# EAGLE board piboard (EAGLE 9.6.2)
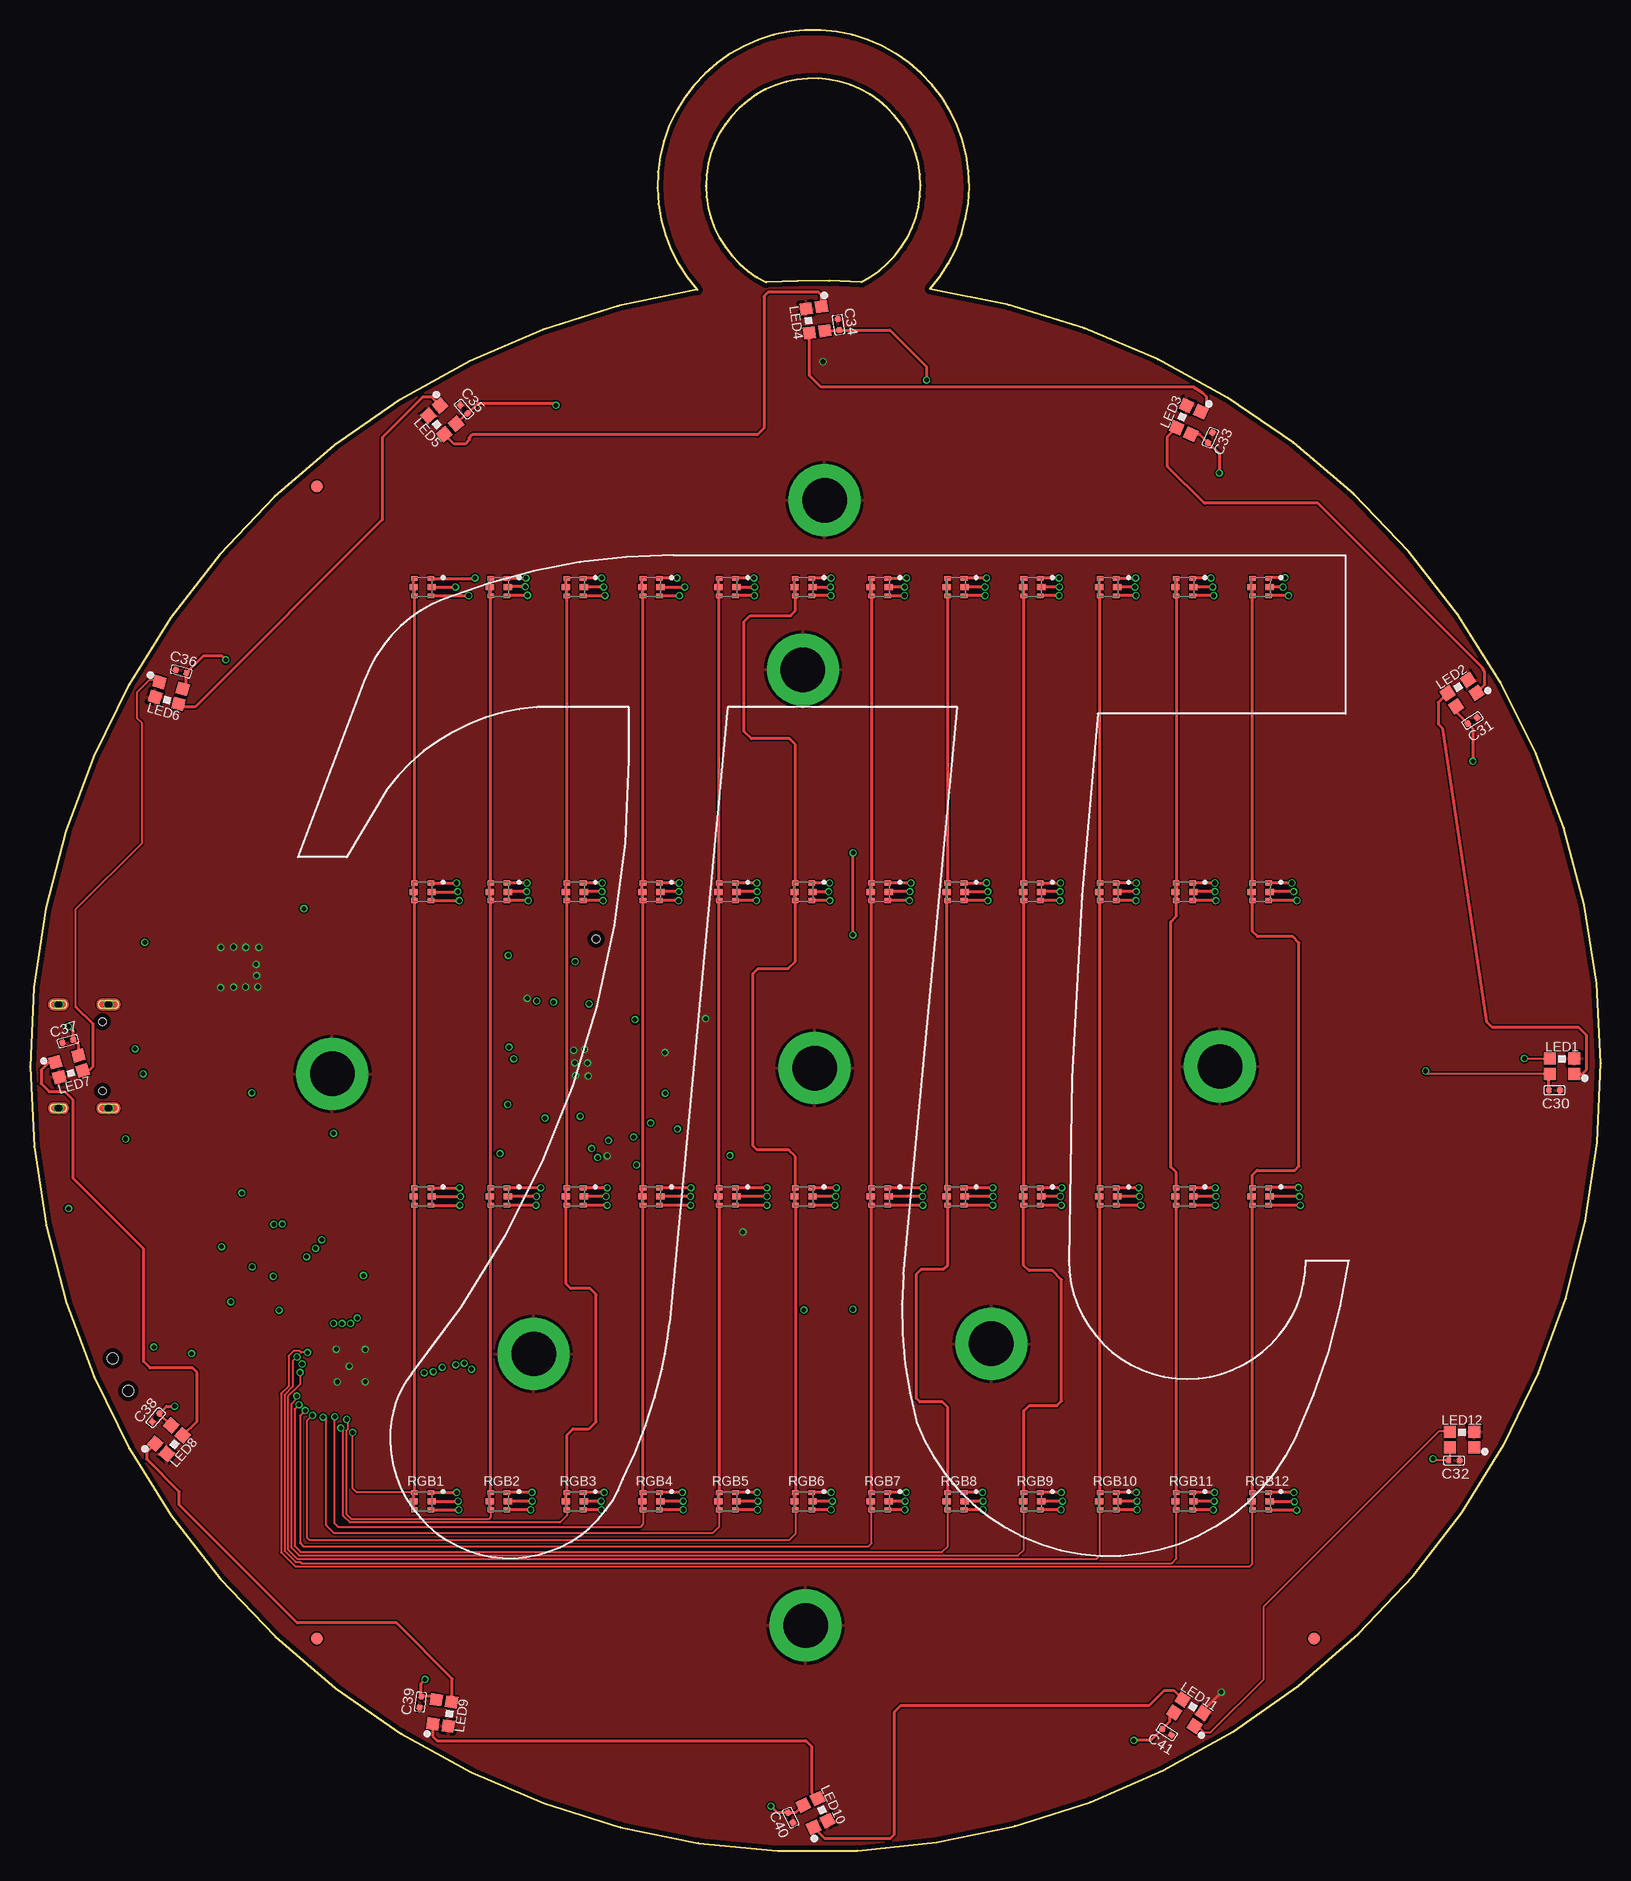
[diagram p5: board, top side]
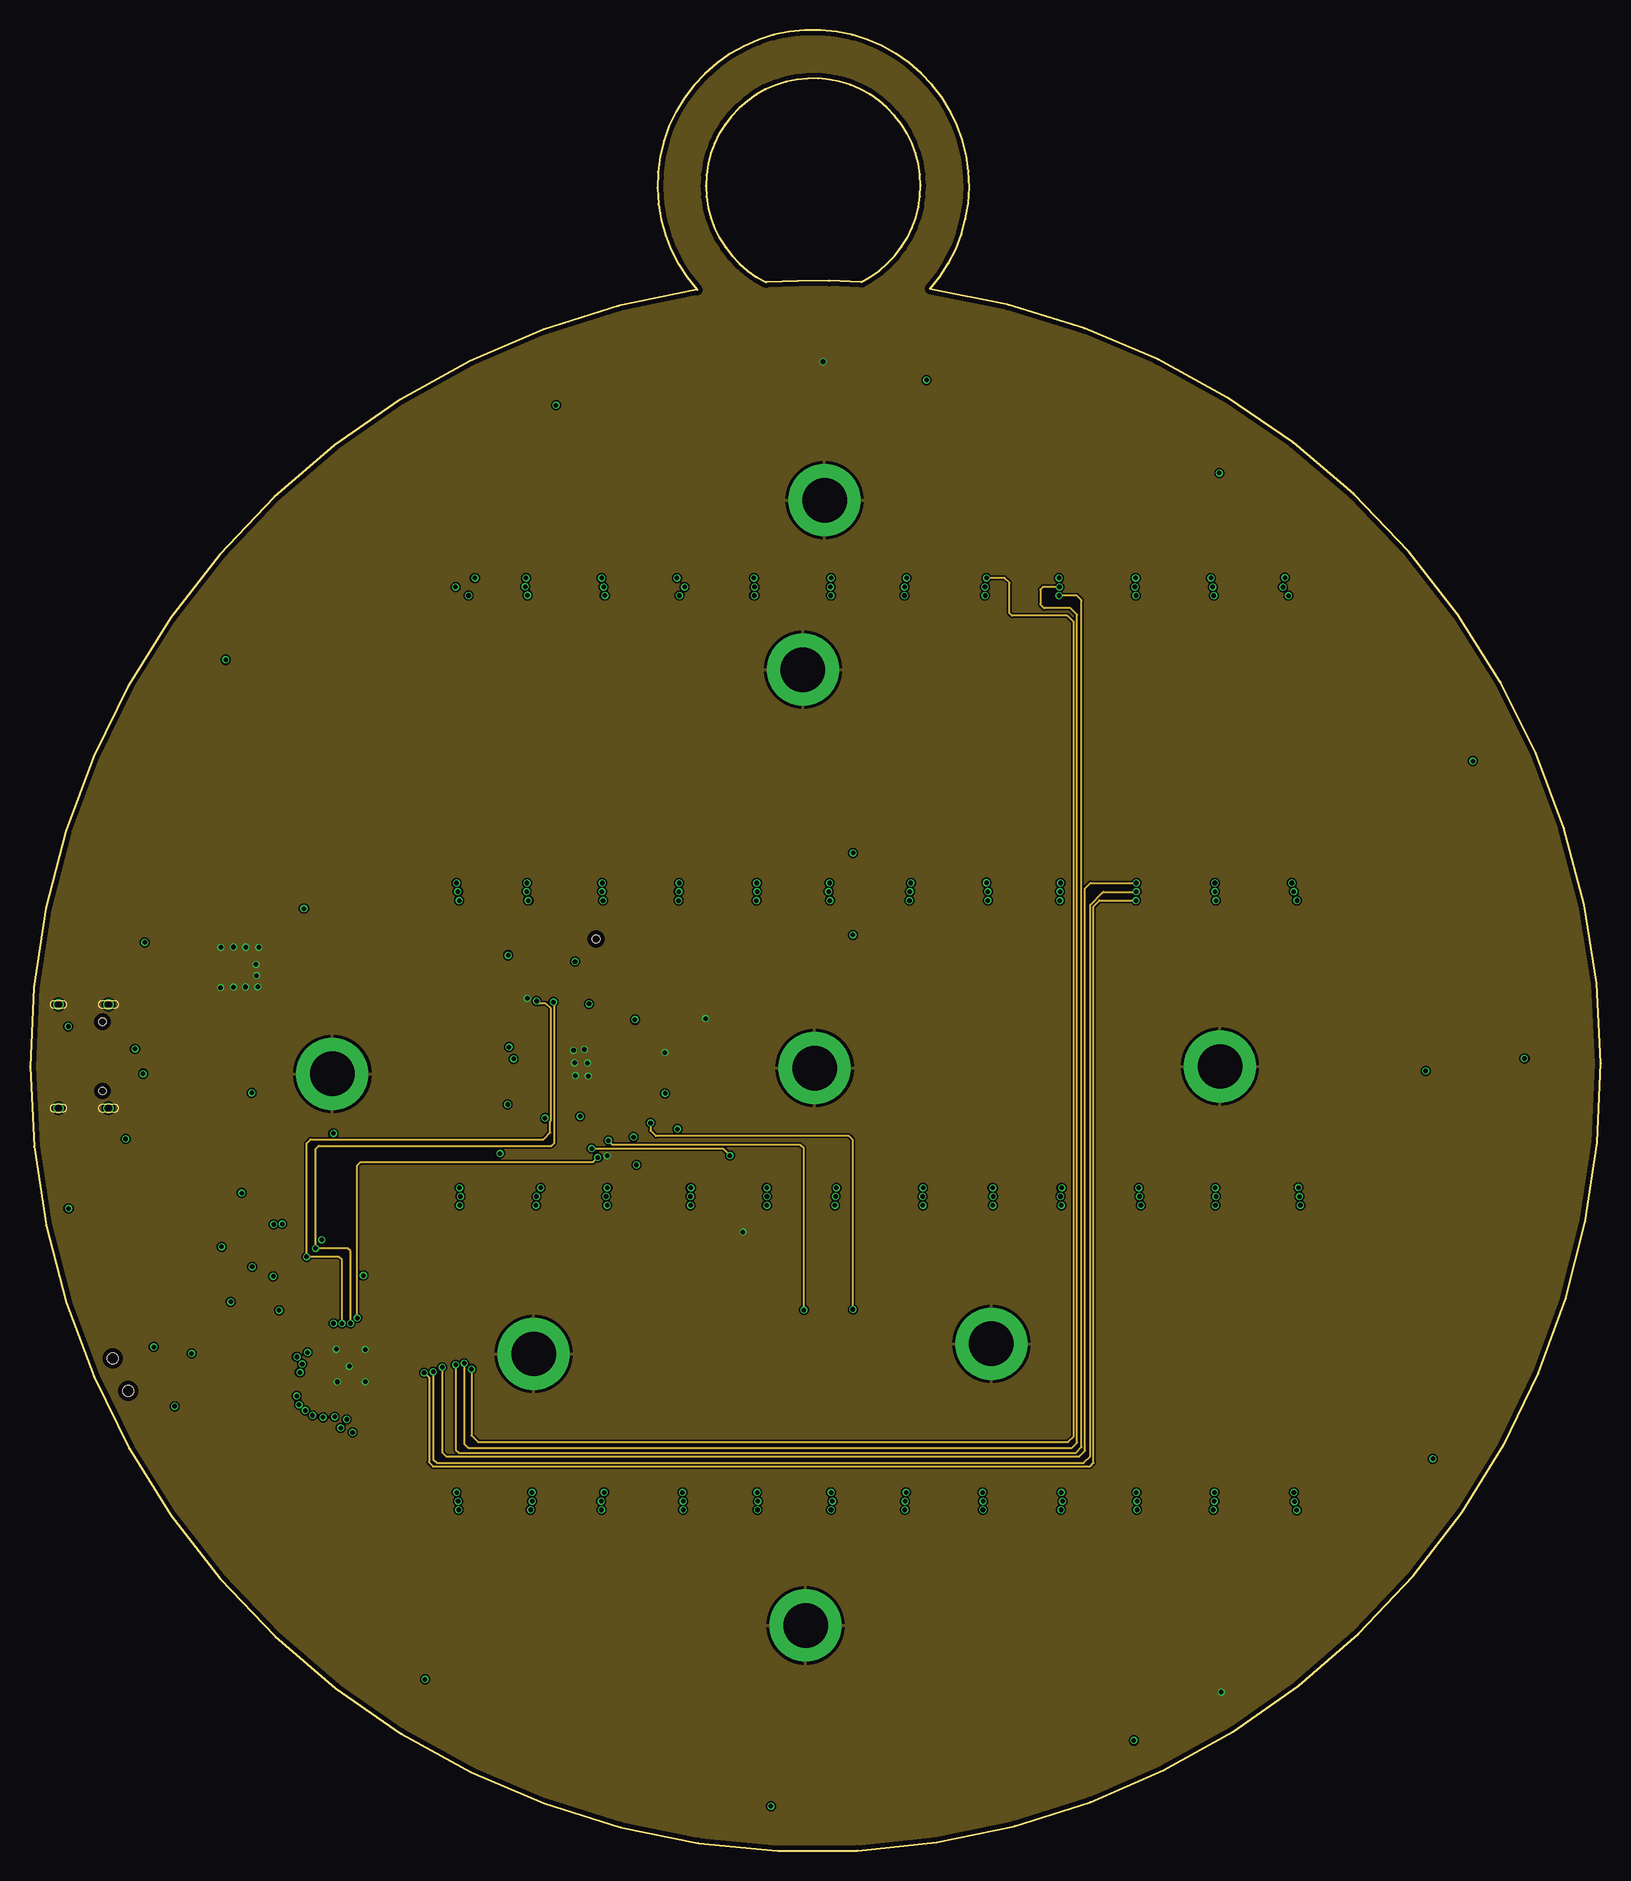
[diagram p6: board, inner layer Route2]
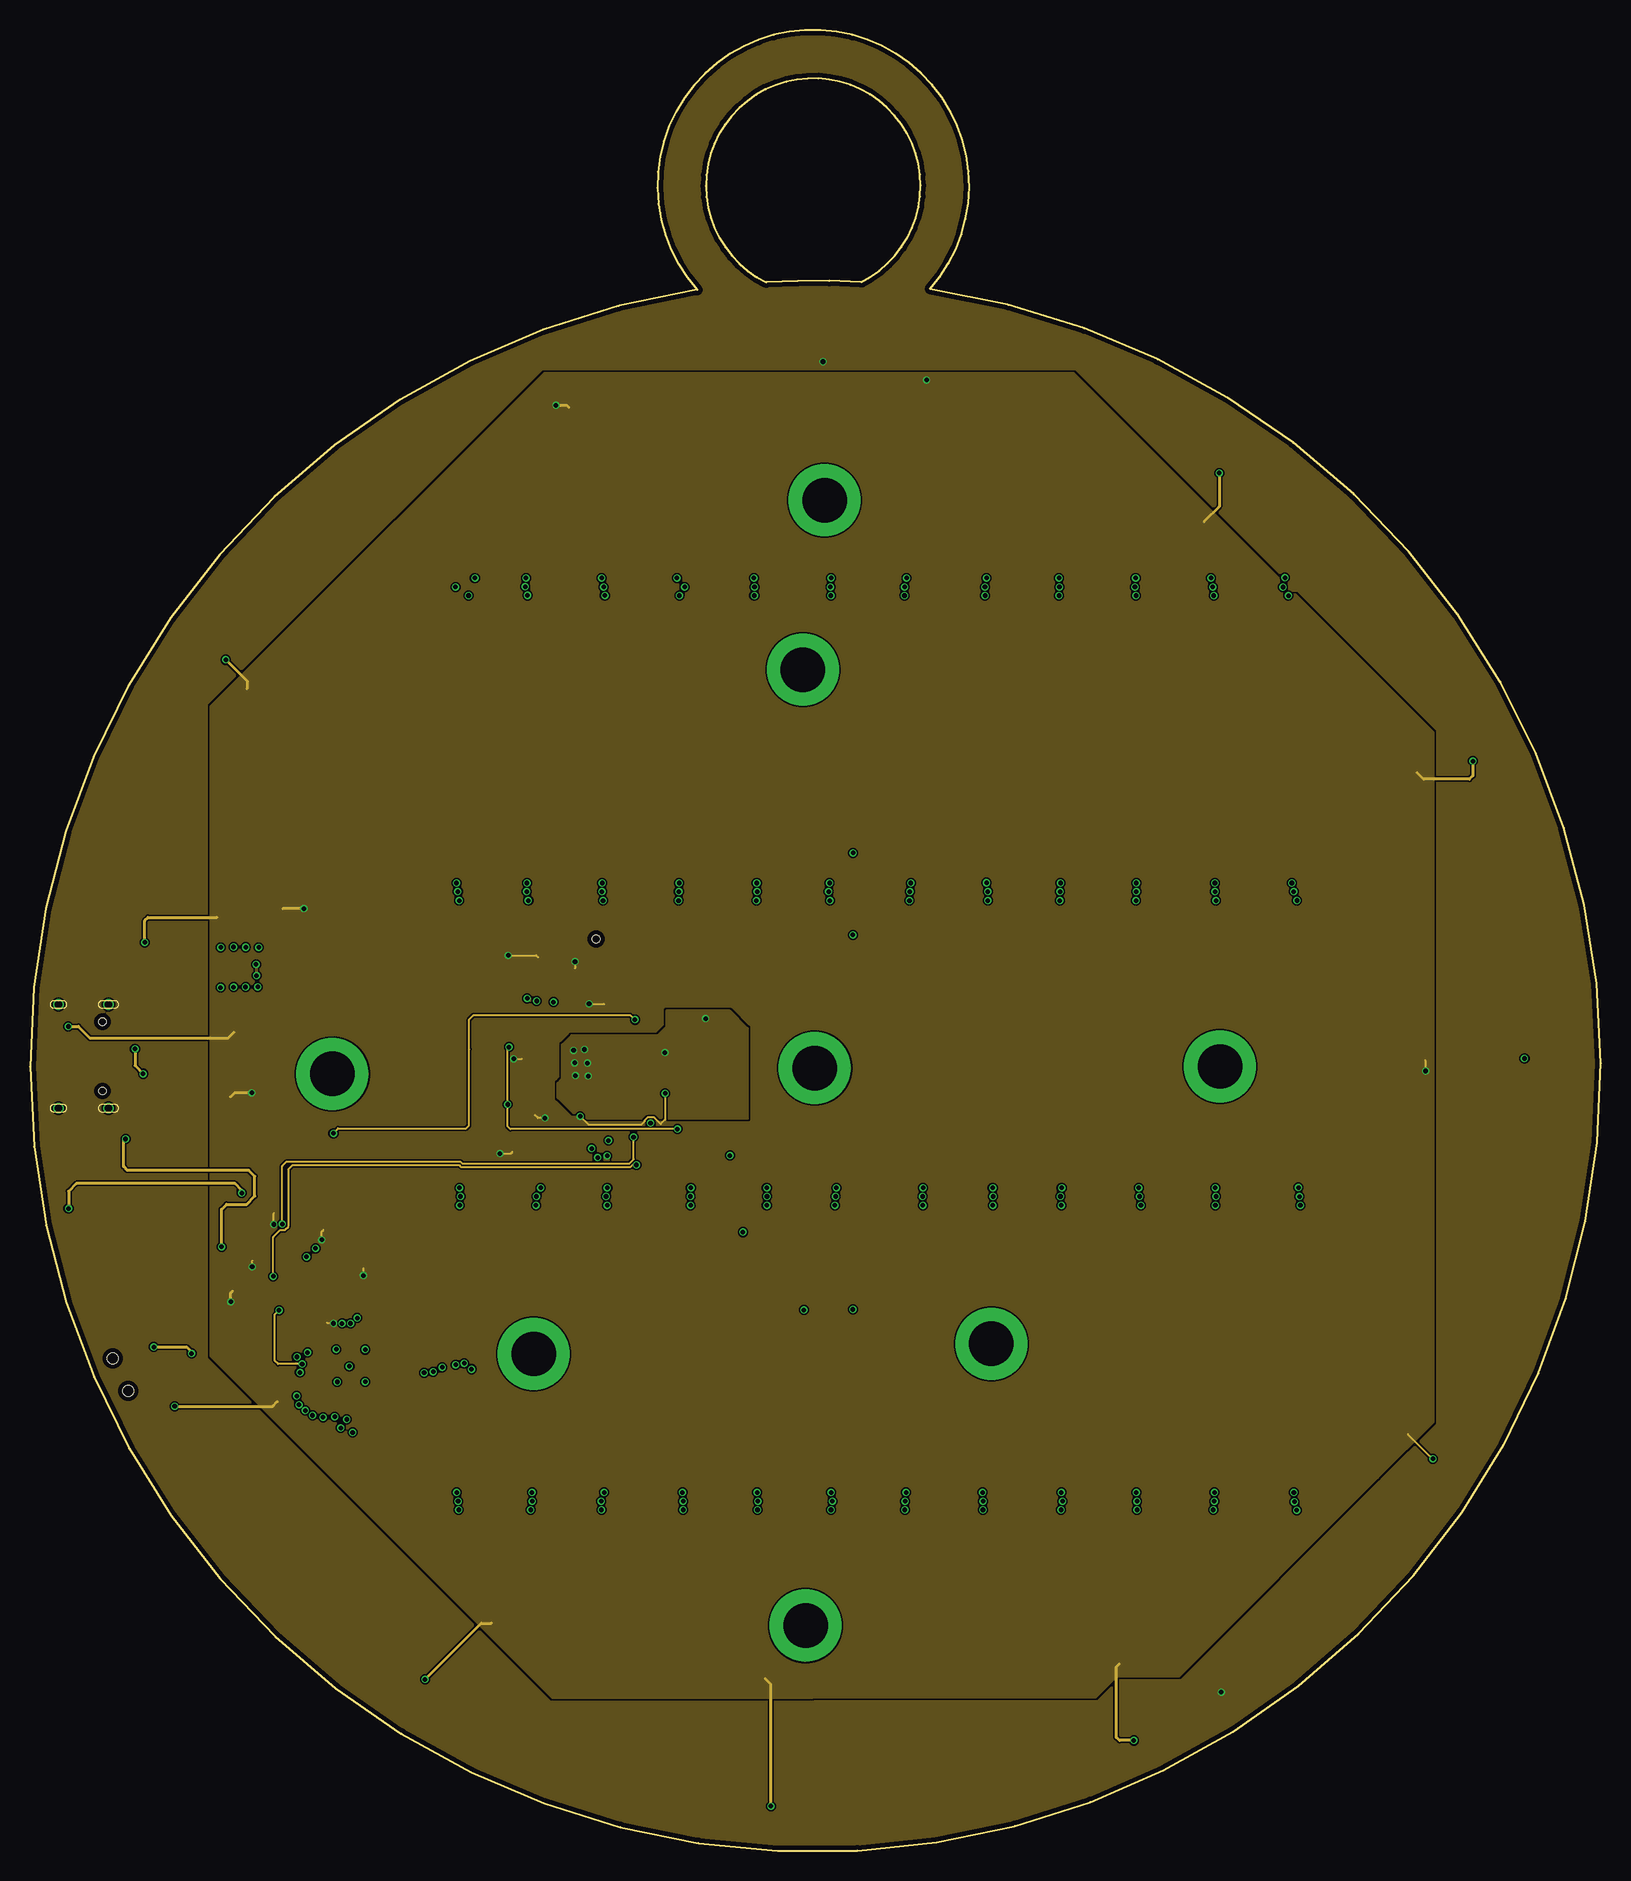
[diagram p7: board, inner layer Route15]
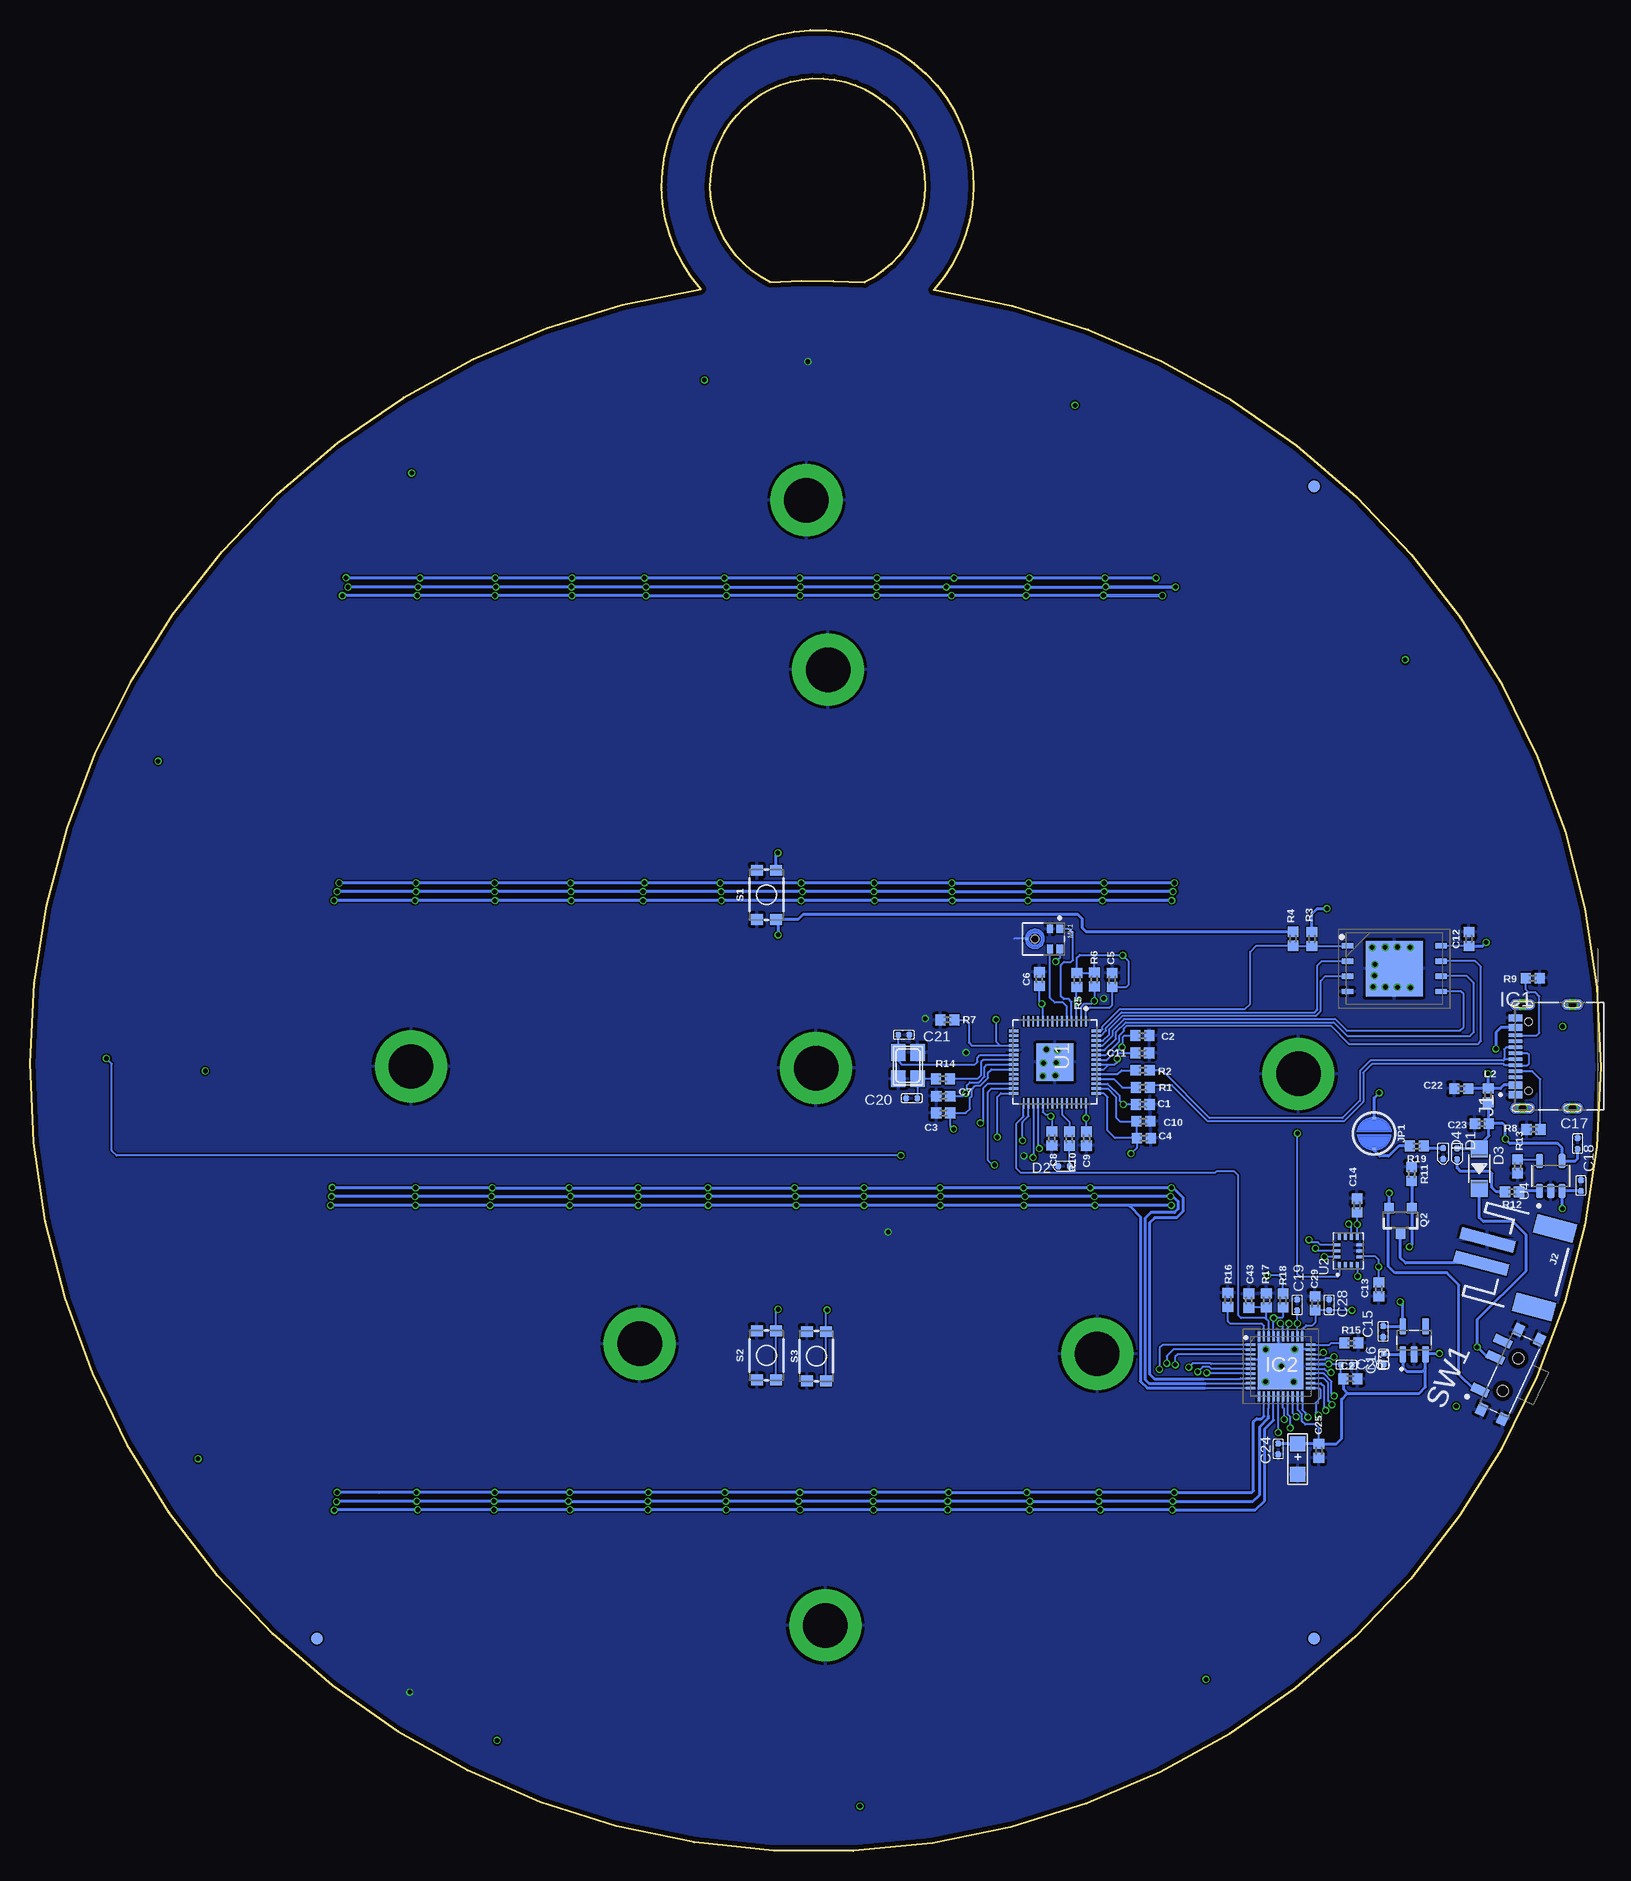
[diagram p8: board, bottom side, seen from below]

Size 130.95 x 151.78 mm. Coordinates in mm from the lower left corner, seen from the top.
Outline: 69.26,130.77 arc308 61.37,130.75 arc-7 69.26,130.77
Outline: 75.03,130.18 arc263 55.61,130.13 arc343 75.03,130.18
Copper layers (1*2*15*16): Top 0.035559375mm / dielectric 0.17018125mm / Route2 0.01778125mm / dielectric 47mil / Route15 0.01778125mm / dielectric 0.17018125mm / Bottom 0.035559375mm
Design rules "oshpark-4layer": minimum track width 5mil, minimum drill 10mil, track to track 5mil, track to pad 5mil, pad to pad 5mil, via to via 5mil, smd to smd 5mil, copper to edge 15mil, drill to drill 6mil, minimum pad ring 4mil, minimum via ring 4mil, stop-mask expansion 1.5mil, vias tented up to drill 0mil, thermal gap 10mil

## Footprints (pad centres in the part's own frame; a part is rotated, then mirrored left to right if it is on the bottom)
0402 = smd 0.85 x 0.9: 1 -0.58,0; 2 0.58,0
C0402 = smd 0.5 x 0.5: 1 0,0.463; 2 0,-0.463
AVX-A = smd 1.27 x 1.27: + -1.27,0; - 1.27,0
LED-0402 = smd 0.5 x 0.5: + -0.463,0; - 0.463,0
SOD-123 = smd 1.397 x 1.397: + -1.651,0; - 1.651,0
FIDUCIAL-1X2 = smd 1 x 1: 1 0,0
M25 = drill 3.7 pad 6: P$1 0.05,0.29
SON127P800X600X80-9N = smd 0.95 x 0.45: 1 -3.9,1.905; 2 -3.9,0.635; 3 -3.9,-0.635; 4 -3.9,-1.905; 5 3.9,-1.905; 6 3.9,-0.635; 7 3.9,0.635; 8 3.9,1.905 | smd 4.75 x 4.65: 9 0,0
QFN40P500X500X80-41N = smd 0.8 x 0.2: 1 -2.5,1.8; 2 -2.5,1.4; 3 -2.5,1; 4 -2.5,0.6; 5 -2.5,0.2; 6 -2.5,-0.2; 7 -2.5,-0.6; 8 -2.5,-1; 9 -2.5,-1.4; 10 -2.5,-1.8; 21 2.5,-1.8; 22 2.5,-1.4; 23 2.5,-1; 24 2.5,-0.6; 25 2.5,-0.2; 26 2.5,0.2; 27 2.5,0.6; 28 2.5,1; 29 2.5,1.4; 30 2.5,1.8 | smd 0.2 x 0.8: 11 -1.8,-2.5; 12 -1.4,-2.5; 13 -1,-2.5; 14 -0.6,-2.5; 15 -0.2,-2.5; 16 0.2,-2.5; 17 0.6,-2.5; 18 1,-2.5; 19 1.4,-2.5; 20 1.8,-2.5; 31 1.8,2.5; 32 1.4,2.5; 33 1,2.5; 34 0.6,2.5; 35 0.2,2.5; 36 -0.2,2.5; 37 -0.6,2.5; 38 -1,2.5; 39 -1.4,2.5; 40 -1.8,2.5 | smd 3.8 x 3.8: 41 0,0
HRO_TYPE-C-31-M-12 = smd 0.6 x 1.14: A1_B12 -3.2,4.75; A4_B9 -2.4,4.75; B1_A12 3.2,4.75; B4_A9 2.4,4.75 | smd 0.3 x 1.14: A5 -1.25,4.75; A6 -0.25,4.75; A7 0.25,4.75; A8 1.25,4.75; B5 1.75,4.75; B6 0.75,4.75; B7 -0.75,4.75; B8 -1.75,4.75 | drill 0.6 pad 0.9: S1 -4.325,4.17; S2 4.325,4.17; S3 -4.325,0; S4 4.325,0 | hole 0.6: -2.89,3.68; 2.89,3.68
JST-2-SMD = smd 1 x 4.6: 1 -1,-3.7; 2 1,-3.7 | smd 1.6 x 3.4: NC1 -3.4,1.5; NC2 3.4,1.5
SMT-JUMPER_2_NO_SILK_ROUND = smd 0.152 x 0.305: 1 -1.27,0; 2 1.27,0
WS2812B-2020 = smd 1 x 1: 1 1.015,-0.65; 2 1.015,0.65; 3 -1.015,0.65; 4 -1.015,-0.65
MIC_ICS-41350 = smd 0.725 x 0.522: 1 -0.838,1.361; 2 -0.838,0.539; 4 0.838,0.539; 5 0.838,1.361 | smd 0.2 x 0.2: 3 -0.015,-1.383 | hole 0.65: 0,-0.713
NX3225 = smd 1.4 x 1.2: 1 -1.1,-0.8; 2 1.1,-0.8; 3 1.1,0.8; 4 -1.1,0.8
SOT23-3 = smd 0.8 x 0.9: 1 -0.95,-1; 2 0.95,-1; 3 0,1.1
LED_19-337C/RSBHGHC-A88/4T = smd 0.55 x 0.4: 1 0.675,0.725; 2 -0.675,0.725; 5 0.675,-0.725; 6 -0.675,-0.725 | smd 0.7 x 0.5: 3 0.75,0; 4 -0.75,0
TACTILE_SWITCH_SMD_4.6X2.8MM = smd 0.9 x 1: 1 -2.05,-0.8; 2 2.05,-0.8; 3 2.05,0.8; 4 -2.05,0.8
SW_PCM12SMTR = smd 0.7 x 1.5: 1 -2.25,1.75; 2 0.75,1.75; 3 2.25,1.75 | smd 1 x 0.8: S1 -3.65,0.965; S2 -3.65,-0.965; S3 3.65,-0.965; S4 3.65,0.965 | hole 0.9: -1.5,0; 1.5,0
QFN40P700X700X90-57N = smd 0.84 x 0.2: 1 -3.435,2.6; 2 -3.435,2.2; 3 -3.435,1.8; 4 -3.435,1.4; 5 -3.435,1; 6 -3.435,0.6; 7 -3.435,0.2; 8 -3.435,-0.2; 9 -3.435,-0.6; 10 -3.435,-1; 11 -3.435,-1.4; 12 -3.435,-1.8; 13 -3.435,-2.2; 14 -3.435,-2.6; 29 3.435,-2.6; 30 3.435,-2.2; 31 3.435,-1.8; 32 3.435,-1.4; 33 3.435,-1; 34 3.435,-0.6; 35 3.435,-0.2; 36 3.435,0.2; 37 3.435,0.6; 38 3.435,1; 39 3.435,1.4; 40 3.435,1.8; 41 3.435,2.2; 42 3.435,2.6 | smd 0.2 x 0.84: 15 -2.6,-3.435; 16 -2.2,-3.435; 17 -1.8,-3.435; 18 -1.4,-3.435; 19 -1,-3.435; 20 -0.6,-3.435; 21 -0.2,-3.435; 22 0.2,-3.435; 23 0.6,-3.435; 24 1,-3.435; 25 1.4,-3.435; 26 1.8,-3.435; 27 2.2,-3.435; 28 2.6,-3.435; 43 2.6,3.435; 44 2.2,3.435; 45 1.8,3.435; 46 1.4,3.435; 47 1,3.435; 48 0.6,3.435; 49 0.2,3.435; 50 -0.2,3.435; 51 -0.6,3.435; 52 -1,3.435; 53 -1.4,3.435; 54 -1.8,3.435; 55 -2.2,3.435; 56 -2.6,3.435 | smd 3.1 x 3.1: 57 0,0
XDCR_BMI270 = smd 0.475 x 0.25: 1 -1.163,0.75; 2 -1.163,0.25; 3 -1.163,-0.25; 4 -1.163,-0.75; 8 1.163,-0.75; 9 1.163,-0.25; 10 1.163,0.25; 11 1.163,0.75 | smd 0.25 x 0.475: 5 -0.5,-0.912; 6 0,-0.912; 7 0.5,-0.912; 12 0.5,0.912; 13 0,0.912; 14 -0.5,0.912
SOT95P280X145-5N = smd 1.39 x 0.58: 1 -1.165,0.95; 2 -1.165,0; 3 -1.165,-0.95; 4 1.165,-0.95; 5 1.165,0.95
SOT95P280X145-5N' = smd 1.22 x 0.6: 1 -1.245,0.95; 2 -1.245,0; 3 -1.245,-0.95; 4 1.245,-0.95; 5 1.245,0.95

## Placement (x,y rotation side)
C1  0.1uF  [0402]  38.2,62.23 0 bottom
C2  0.1uF  [0402]  38.23,67.96 0 bottom
C3  1.0uF  [0402]  54.83,61.5 180 bottom
C4  1.0uF  [0402]  38.11,59.41 0 bottom
C5  0.1uF  [0402]  40.74,72.6 90 bottom
C6  0.1uF  [0402]  46.82,72.66 90 bottom
C7  0.1uF  [0402]  54.83,62.91 180 bottom
C8  0.1uF  [0402]  45.77,59.39 270 bottom
C9  0.1uF  [0402]  42.89,59.37 270 bottom
C10  0.1uF  [0402]  38.13,60.82 0 bottom
C11  0.1uF  [0402]  38.24,66.51 0 bottom
C12  0.1uF  [0402]  11,76.01 90 bottom
C13  0.1uF  [0402]  18.52,46.8 270 bottom
C14  0.1uF  [0402]  20.33,53.79 90 bottom
C15  10uF  [C0402]  18.15,43.29 180 bottom
C16  10uF  [C0402]  18.12,41 180 bottom
C17  4.7uF  [C0402]  1.94,58.96 0 bottom
C18  4.7uF  [C0402]  1.68,55.46 0 bottom
C19  470nF 50V  [C0402]  25.33,45.5 180 bottom
C20  33pf  [C0402]  57.45,62.74 90 bottom
C21  33pf  [C0402]  58.11,68.02 270 bottom
C22  0.1uF  [0402]  11.64,63.54 180 bottom
C23  0.1uF  [0402]  9.92,60.61 180 bottom
C24  470nF 50V  [C0402]  26.9,33.5 180 bottom
C25  0.1uF  [0402]  23.51,33.34 270 bottom
C26  470nF 50V  [C0402]  21.22,40.52 270 bottom
C27  0.1uF  [0402]  20.89,39.35 0 bottom
C28  470nF 50V  [C0402]  22.66,45.52 0 bottom
C29  0.1uF  [0402]  23.83,45.65 90 bottom
C30  100nf  [C0402]  127.08,63.4 270 top
C31  100nf  [C0402]  120.24,94.23 303 top
C32  100nf  [C0402]  118.71,32.54 270 top
C33  100nf  [C0402]  98.39,117.8 336 top
C34  100nf  [C0402]  67.4,127.23 8 top
C35  100nf  [C0402]  36.18,120.17 41 top
C36  100nf  [C0402]  12.6,98.32 74 top
C37  100nf  [C0402]  3.16,67.49 106 top
C38  100nf  [C0402]  10.49,36.11 139 top
C39  100nf  [C0402]  32.55,12.41 172 top
C40  100nf  [C0402]  63.4,2.77 205 top
C41  100nf  [C0402]  94.77,9.91 237 top
C42  22uF  [AVX-A]  25.28,32.66 270 bottom
C43  0.1uF  [0402]  29.35,45.87 270 bottom
D1  BLUE-0402  [LED-0402]  11.99,58.1 270 bottom
D2  BLUE-0402  [LED-0402]  44.77,57.06 180 bottom
D3  20V-1A  [SOD-123]  10.14,56.86 270 bottom
D4  RED-0402  [LED-0402]  13.15,58.12 270 bottom
FD1  FIDUCIAL1X2  [FIDUCIAL-1X2]  23.91,113.73 0 top
FD2  FIDUCIAL1X2  [FIDUCIAL-1X2]  23.91,113.73 0 bottom
FD3  FIDUCIAL1X2  [FIDUCIAL-1X2]  23.91,17.72 0 top
FD4  FIDUCIAL1X2  [FIDUCIAL-1X2]  23.91,17.72 0 bottom
FD5  FIDUCIAL1X2  [FIDUCIAL-1X2]  107.05,17.72 0 top
FD6  FIDUCIAL1X2  [FIDUCIAL-1X2]  107.05,17.72 0 bottom
H1  M25  [M25]  64.37,98.17 0 top
H2  M25  [M25]  65.36,64.96 0 top
H3  M25  [M25]  41.94,41.14 0 top
H4  M25  [M25]  64.61,18.49 0 top
H5  M25  [M25]  66.19,112.29 0 top
H6  M25  [M25]  99.15,65.1 0 top
H7  M25  [M25]  80.08,41.99 0 top
H8  M25  [M25]  25.16,64.48 0 top
IC1  IS25LP256D-JLLE-TR  [SON127P800X600X80-9N]  17.24,73.54 0 bottom
IC2  IS31FL3737-QFLS4-TR  [QFN40P500X500X80-41N]  26.7,40.39 0 bottom
J1  TYPE-C-31-M-12  [HRO_TYPE-C-31-M-12]  2.37,66.23 90 bottom
J2  [JST-2-SMD]  6.15,49 255 bottom
JP1  JUMPER-SMT_2_NO_SILK_ROUND  [SMT-JUMPER_2_NO_SILK_ROUND]  18.9,59.8 270 bottom
L2  2.2nH  [0402]  9.4,62.97 270 bottom
LED1  WS2812B-2020  [WS2812B-2020]  127.71,65.4 0 top
LED2  WS2812B-2020  [WS2812B-2020]  119.37,96.52 33 top
LED3  WS2812B-2020  [WS2812B-2020]  96.59,119.29 66 top
LED4  WS2812B-2020  [WS2812B-2020]  65.48,127.63 98 top
LED5  WS2812B-2020  [WS2812B-2020]  34.36,119.29 131 top
LED6  WS2812B-2020  [WS2812B-2020]  11.58,96.52 164 top
LED7  WS2812B-2020  [WS2812B-2020]  3.25,65.4 196 top
LED8  WS2812B-2020  [WS2812B-2020]  11.58,34.29 229 top
LED9  WS2812B-2020  [WS2812B-2020]  34.36,11.51 262 top
LED10  WS2812B-2020  [WS2812B-2020]  65.48,3.17 295 top
LED11  WS2812B-2020  [WS2812B-2020]  96.59,11.51 327 top
LED12  WS2812B-2020  [WS2812B-2020]  119.37,34.29 0 top
MK1  ICS-41350  [MIC_ICS-41350]  46.47,76.02 270 bottom
Q1  [NX3225]  57.77,65.46 270 bottom
Q2  2.5A/30V/105mΩ  [SOT23-3]  16.72,52.58 180 bottom
R1  27  [0402]  38.19,63.64 0 bottom
R2  27  [0402]  38.2,65.07 0 bottom
R3  10K  [0402]  24.09,76.01 90 bottom
R4  10K  [0402]  25.67,76.03 90 bottom
R5  4.7K  [0402]  43.68,72.6 90 bottom
R6  4.7K  [0402]  42.23,72.63 90 bottom
R7  10K  [0402]  54.48,69.27 0 bottom
R8  5.1K  [0402]  5.62,60.15 0 bottom
R9  5.1K  [0402]  5.68,72.75 180 bottom
R10  330  [0402]  44.31,59.36 270 bottom
R11  10K  [0402]  15.78,56.42 270 bottom
R12  470  [0402]  7.41,54.94 180 bottom
R13  2K  [0402]  6.95,57.07 90 bottom
R14  [0402]  54.85,64.36 0 bottom
R15  20K  [0402]  20.81,42.34 0 bottom
R16  100K  [0402]  31.09,45.93 270 bottom
R17  100K  [0402]  27.89,45.89 270 bottom
R18  100K  [0402]  26.5,45.87 90 bottom
R19  220  [0402]  15.35,58.75 180 bottom
RGB1  19-337C/RSBHGHC-A88/4T  [LED_19-337C/RSBHGHC-A88/4T]  32.73,29.15 0 top
RGB2  19-337C/RSBHGHC-A88/4T  [LED_19-337C/RSBHGHC-A88/4T]  39.08,29.15 0 top
RGB3  19-337C/RSBHGHC-A88/4T  [LED_19-337C/RSBHGHC-A88/4T]  45.43,29.15 0 top
RGB4  19-337C/RSBHGHC-A88/4T  [LED_19-337C/RSBHGHC-A88/4T]  51.78,29.15 0 top
RGB5  19-337C/RSBHGHC-A88/4T  [LED_19-337C/RSBHGHC-A88/4T]  58.13,29.15 0 top
RGB6  19-337C/RSBHGHC-A88/4T  [LED_19-337C/RSBHGHC-A88/4T]  64.48,29.15 0 top
RGB7  19-337C/RSBHGHC-A88/4T  [LED_19-337C/RSBHGHC-A88/4T]  70.83,29.15 0 top
RGB8  19-337C/RSBHGHC-A88/4T  [LED_19-337C/RSBHGHC-A88/4T]  77.18,29.15 0 top
RGB9  19-337C/RSBHGHC-A88/4T  [LED_19-337C/RSBHGHC-A88/4T]  83.53,29.15 0 top
RGB10  19-337C/RSBHGHC-A88/4T  [LED_19-337C/RSBHGHC-A88/4T]  89.88,29.15 0 top
RGB11  19-337C/RSBHGHC-A88/4T  [LED_19-337C/RSBHGHC-A88/4T]  96.23,29.15 0 top
RGB12  19-337C/RSBHGHC-A88/4T  [LED_19-337C/RSBHGHC-A88/4T]  102.58,29.15 0 top
RGB13  19-337C/RSBHGHC-A88/4T  [LED_19-337C/RSBHGHC-A88/4T]  32.73,54.55 0 top
RGB14  19-337C/RSBHGHC-A88/4T  [LED_19-337C/RSBHGHC-A88/4T]  39.08,54.55 0 top
RGB15  19-337C/RSBHGHC-A88/4T  [LED_19-337C/RSBHGHC-A88/4T]  45.43,54.55 0 top
RGB16  19-337C/RSBHGHC-A88/4T  [LED_19-337C/RSBHGHC-A88/4T]  51.78,54.55 0 top
RGB17  19-337C/RSBHGHC-A88/4T  [LED_19-337C/RSBHGHC-A88/4T]  58.13,54.55 0 top
RGB18  19-337C/RSBHGHC-A88/4T  [LED_19-337C/RSBHGHC-A88/4T]  64.48,54.55 0 top
RGB19  19-337C/RSBHGHC-A88/4T  [LED_19-337C/RSBHGHC-A88/4T]  70.83,54.55 0 top
RGB20  19-337C/RSBHGHC-A88/4T  [LED_19-337C/RSBHGHC-A88/4T]  77.18,54.55 0 top
RGB21  19-337C/RSBHGHC-A88/4T  [LED_19-337C/RSBHGHC-A88/4T]  83.53,54.55 0 top
RGB22  19-337C/RSBHGHC-A88/4T  [LED_19-337C/RSBHGHC-A88/4T]  89.88,54.55 0 top
RGB23  19-337C/RSBHGHC-A88/4T  [LED_19-337C/RSBHGHC-A88/4T]  96.23,54.55 0 top
RGB24  19-337C/RSBHGHC-A88/4T  [LED_19-337C/RSBHGHC-A88/4T]  102.58,54.55 0 top
RGB25  19-337C/RSBHGHC-A88/4T  [LED_19-337C/RSBHGHC-A88/4T]  32.73,79.95 0 top
RGB26  19-337C/RSBHGHC-A88/4T  [LED_19-337C/RSBHGHC-A88/4T]  39.08,79.95 0 top
RGB27  19-337C/RSBHGHC-A88/4T  [LED_19-337C/RSBHGHC-A88/4T]  45.43,79.95 0 top
RGB28  19-337C/RSBHGHC-A88/4T  [LED_19-337C/RSBHGHC-A88/4T]  51.78,79.95 0 top
RGB29  19-337C/RSBHGHC-A88/4T  [LED_19-337C/RSBHGHC-A88/4T]  58.13,79.95 0 top
RGB30  19-337C/RSBHGHC-A88/4T  [LED_19-337C/RSBHGHC-A88/4T]  64.48,79.95 0 top
RGB31  19-337C/RSBHGHC-A88/4T  [LED_19-337C/RSBHGHC-A88/4T]  70.83,79.95 0 top
RGB32  19-337C/RSBHGHC-A88/4T  [LED_19-337C/RSBHGHC-A88/4T]  77.18,79.95 0 top
RGB33  19-337C/RSBHGHC-A88/4T  [LED_19-337C/RSBHGHC-A88/4T]  83.53,79.95 0 top
RGB34  19-337C/RSBHGHC-A88/4T  [LED_19-337C/RSBHGHC-A88/4T]  89.88,79.95 0 top
RGB35  19-337C/RSBHGHC-A88/4T  [LED_19-337C/RSBHGHC-A88/4T]  96.23,79.95 0 top
RGB36  19-337C/RSBHGHC-A88/4T  [LED_19-337C/RSBHGHC-A88/4T]  102.58,79.95 0 top
RGB37  19-337C/RSBHGHC-A88/4T  [LED_19-337C/RSBHGHC-A88/4T]  32.73,105.35 0 top
RGB38  19-337C/RSBHGHC-A88/4T  [LED_19-337C/RSBHGHC-A88/4T]  39.08,105.35 0 top
RGB39  19-337C/RSBHGHC-A88/4T  [LED_19-337C/RSBHGHC-A88/4T]  45.43,105.35 0 top
RGB40  19-337C/RSBHGHC-A88/4T  [LED_19-337C/RSBHGHC-A88/4T]  51.78,105.35 0 top
RGB41  19-337C/RSBHGHC-A88/4T  [LED_19-337C/RSBHGHC-A88/4T]  58.13,105.35 0 top
RGB42  19-337C/RSBHGHC-A88/4T  [LED_19-337C/RSBHGHC-A88/4T]  64.48,105.35 0 top
RGB43  19-337C/RSBHGHC-A88/4T  [LED_19-337C/RSBHGHC-A88/4T]  70.83,105.35 0 top
RGB44  19-337C/RSBHGHC-A88/4T  [LED_19-337C/RSBHGHC-A88/4T]  77.18,105.35 0 top
RGB45  19-337C/RSBHGHC-A88/4T  [LED_19-337C/RSBHGHC-A88/4T]  83.53,105.35 0 top
RGB46  19-337C/RSBHGHC-A88/4T  [LED_19-337C/RSBHGHC-A88/4T]  89.88,105.35 0 top
RGB47  19-337C/RSBHGHC-A88/4T  [LED_19-337C/RSBHGHC-A88/4T]  96.23,105.35 0 top
RGB48  19-337C/RSBHGHC-A88/4T  [LED_19-337C/RSBHGHC-A88/4T]  102.58,105.35 0 top
S1  MOMENTARY-SWITCH-SPST-SMD-4.6X2.8MM  [TACTILE_SWITCH_SMD_4.6X2.8MM]  69.56,79.7 90 bottom
S2  MOMENTARY-SWITCH-SPST-SMD-4.6X2.8MM  [TACTILE_SWITCH_SMD_4.6X2.8MM]  69.56,41.31 90 bottom
S3  MOMENTARY-SWITCH-SPST-SMD-4.6X2.8MM  [TACTILE_SWITCH_SMD_4.6X2.8MM]  65.4,41.24 90 bottom
SW1  PCM12SMTR  [SW_PCM12SMTR]  7.54,39.71 65 bottom
U1  RP2040  [QFN40P700X700X90-57N]  45.52,65.74 270 bottom
U2  BMI270  [XDCR_BMI270]  21.07,50.02 90 bottom
U3  MIC5504-3.3YM5_TR  [SOT95P280X145-5N]  15.58,42.57 90 bottom
U4  MCP73831T-2ATI/OT  [SOT95P280X145-5N']  4.19,56.25 90 bottom

## Tracks (layer width: path | path; a pad name or v marks a point on that pad's centre or on a via)
3.3V  (via drill 0.38)
  Top 0.152: LED12.4 118.36,32.65 C32.2 117.1,32.54 v116.95,32.69 | LED1.4 116.6,64.75 v116.34,65.01
  Top 0.254: C30.2 126.62,64.67 LED1.4 | LED2.4 118.87,94.95 C31.2 120.28,93.54 v120.28,90.84 | LED4.4 67.41,126.72 C34.2 71.68,126.77 74.74,123.71 v74.74,122.61 | LED3.4 97.48,118.1 C33.2 99.13,116.45 v99.13,114.86 | LED5.4 36.39,119.82 C35.2 37.35,120.69 43.65,120.69 v43.84,120.5 | LED6.4 13.04,97.16 C36.2 14.47,99.62 15.98,99.62 v16.32,99.28 | LED7.4 4.04,67.18 C37.2 3.61,68.31 v3.19,68.72 | LED8.4 C38.2 11.39,37.06 v12.06,37.06 | LED9.4 33.59,12.87 C39.2 32.61,13.97 v32.93,14.29 | LED10.4 63.83,3.19 C40.2 62.32,3.19 v61.77,3.74 | LED11.4 95.02,11.14 95.02,10.79 C41.2 93.42,9.2 v92.02,9.2
  Route15 0.152: v116.95,32.69 116.89,32.69 114.86,34.73 | v116.34,65.01 116.34,65.86 116.3,65.91 | v40.32,66.02 40.98,66.02 40.99,66.03 | v39.17,58.13 40.07,58.13 40.22,58.28 | v39.87,74.66 42.2,74.66 42.37,74.48 | v46.6,70.6 47.83,70.6 47.88,70.56 | v45.44,74.12 45.44,73.57 45.42,73.56 | v42.92,61.08 42.35,61.08 42.08,61.34 | v25.3,43.97 24.8,43.97 24.76,44.02 | v52.95,63.15 52.95,60.96 52.58,60.59 52,61.17 51.53,61.17 51.23,60.87 51.23,60.81 50.96,60.55 46.56,60.55 v45.87,61.24 | v18.52,48.68 18.52,49.19 18.56,49.22 | v20.32,52.22 20.32,53.16 20.33,53.17 | v27.79,47.96 27.8,47.97 27.8,48.59 | v24.33,50.93 24.33,51.63 24.47,51.78
  Route15 0.254: v99.13,114.86 99.13,112.06 97.86,110.79 | v120.28,90.84 120.28,89.62 119.99,89.33 116.17,89.33 115.63,89.86 | v43.84,120.5 44.74,120.5 44.92,120.32 | v16.32,99.28 18.08,97.52 18.08,96.89 | v3.19,68.72 4.03,68.72 4.99,67.75 16.51,67.75 17,68.24 | v12.06,37.06 20.21,37.06 20.61,37.46 | v32.93,14.29 37.62,18.98 38.47,18.98 | v61.77,3.74 61.77,13.89 61.3,14.36 | v92.02,9.2 90.82,9.2 90.55,9.47 90.55,15.34 90.78,15.57 | v9.58,75.73 9.58,77.53 9.85,77.81 15.58,77.81 | v18.49,63.19 17.07,63.19 16.73,62.85 | v22.83,78.55 21.1,78.55 | v16.74,45.78 16.74,46.52 16.88,46.66
  Bottom 0.152: U1.49 41.02,65.54 | 41.02,65.54 40.55,65.54 40.32,65.77 v40.32,66.02 40.32,66.33 40.14,66.51 C11.1 | C12.1 13.32,75.43 IC1.8 | C10.1 | C10.1 40.1,60.82 40.42,61.14 40.42,62.84 41.12,63.54 U1.44 | U1.43 41.45,63.14 41.14,62.83 41.14,60.04 40.51,59.41 38.78,59.41 | 38.78,59.41 C4.1 38.69,58.61 v39.17,58.13 | C10.1 38.71,59.47 38.78,59.41 | C9.1 42.92,59.98 v42.92,61.08 U1.42 | U1.1 42.92,69.97 42.58,70.31 40.95,70.31 40.74,70.52 C5.1 39.57,72.02 39.36,72.23 39.36,74.15 v39.87,74.66 39.9,74.68 42.06,74.68 | 42.06,74.68 42.23,74.52 R6.2 42.26,73.18 R5.2 43.68,74.45 43.45,74.68 42.06,74.68 | U1.10 46.52,70.52 v46.6,70.6 46.83,70.82 46.83,72.08 C6.1 | MK1.5 45.11,74.45 v45.44,74.12 | U2.8 v20.32,52.22 20.32,53.2 C14.1 20.35,53.2 | IC2.32 v25.3,43.97 25.3,45.01 C19.1 | C7.1 53.19,62.91 v52.95,63.15 52.85,63.24 52.85,63.82 52.61,64.07 51.86,64.07 51.39,64.54 51.39,65.32 51.17,65.54 U1.22 | C13.1 v18.52,48.68 18.52,49.26 18.8,49.53 20.14,49.53 U2.5 | U1.33 46.52,61.59 46.32,61.39 46.02,61.39 v45.87,61.24 45.77,61.14 C8.1 | R18.2 26.5,47.64 26.84,47.98 27.77,47.98 v27.79,47.96 | U2.12 23.38,50.52 23.59,50.73 24.12,50.73 v24.33,50.93 | U1.48 41.42,65.14 41.02,65.54
  Bottom 0.254: C12.1 9.87,75.43 v9.58,75.73 | JP1.1 18.9,62.78 v18.49,63.19 | C15.2 18.13,43.73 U3.5 16.53,45.57 v16.74,45.78 | R3.2 24.09,78.1 23.64,78.55 v22.83,78.55
  pour Route15 (rank 2): 65.18,12.75 43.58,12.75 37.41,18.92 15.12,41.2 15.12,69.62 15.12,95.42 18.25,98.54 42.88,123.17 70.88,123.17 86.99,123.17 93.39,116.78 116.93,93.24 116.93,91.43 116.93,35.72 112.33,31.12 95.76,14.55 90.56,14.55 88.8,12.79 65.15,12.79
!BOOT  (via drill 0.38)
  Top 0.254: v68.59,76.36 68.59,83.17 v68.61,83.19
  Bottom 0.254: R4.2 42.91,76.61 43.24,76.95 43.24,77.69 43.61,78.05 66.52,78.05 66.92,77.65 S1.1 68.59,77.48 v68.59,76.36 | S1.2 68.76,83.04 v68.61,83.19
!RESET  (via drill 0.38)
  Route2 0.152: v68.59,45.14 68.59,59.26 68.25,59.59 52.17,59.59 51.73,60.03 v51.73,60.67
  Bottom 0.152: S2.1 S2.2 68.76,44.97 v68.59,45.14 | U1.26 51.14,63.94 51.51,63.57 51.51,62.73 51.5,62.72 51.5,60.74 51.7,60.55 51.73,60.58 v51.73,60.67
CLK
  Bottom 0.152: U1.5 44.52,70.39 44.84,70.71 45.52,70.71 45.93,71.11 MK1.4
CS1  (via drill 0.38)
  Top 0.152: RGB1.2 27.24,29.87 26.9,30.21 v26.9,34.88
  Top 0.254: RGB1.6 31.98,28.5 RGB1.4 31.98,29.8 RGB1.2 RGB13.6 32.05,54.47 RGB13.4 31.98,55.2 RGB13.2 RGB25.6 32.05,79.87 RGB25.4 31.98,80.6 RGB25.2 RGB37.6 32.05,105.27 RGB37.4 31.98,106 RGB37.2
  Bottom 0.152: v26.9,34.88 IC2.15 | IC2.15
CS2  (via drill 0.38)
  Top 0.152: RGB2.6 38.4,27.85 38.21,27.65 26.79,27.65 26.4,28.04 26.4,35.08 26.52,35.2 26.52,35.85 v26.4,35.97
  Top 0.254: RGB38.2 38.33,106 RGB38.4 38.4,105.27 RGB38.6 RGB26.2 38.33,80.6 RGB26.4 38.4,79.87 RGB26.6 RGB14.2 38.33,55.2 RGB14.4 38.4,54.47 RGB14.6 RGB2.2 38.33,29.8 RGB2.4 38.4,29.07 RGB2.6
  Bottom 0.152: v26.4,35.97 26.4,36.85 26.5,36.95 IC2.16
CS3  (via drill 0.38)
  Top 0.152: RGB3.6 44.75,27.95 44.17,27.37 26.68,27.37 26.12,27.93 26.12,35.03 v25.91,35.25
  Top 0.254: RGB3.6 44.75,29.07 RGB3.4 44.68,29.8 RGB3.2 44.75,34.67 45.27,35.18 46.6,35.18 47.19,35.77 47.19,46.37 46.68,46.88 45.08,46.88 44.67,47.28 44.67,53.75 RGB15.6 44.68,53.9 RGB15.4 44.68,55.2 RGB15.2 RGB27.6 44.75,79.87 RGB27.4 44.68,80.6 RGB27.2 RGB39.6 44.75,105.27 RGB39.4 44.68,106 RGB39.2
  Bottom 0.152: v25.91,35.25 25.91,36.17 26.1,36.37 IC2.17
CS4  (via drill 0.38)
  Top 0.152: RGB4.6 51.1,27.24 50.84,26.98 25.72,26.98 25.41,27.29 v25.41,36.19
  Top 0.254: RGB4.6 51.03,28.5 RGB4.4 51.03,29.8 RGB4.2 RGB16.6 51.1,54.47 RGB16.4 51.03,55.2 RGB16.2 RGB28.6 51.1,79.87 RGB28.4 51.03,80.6 RGB28.2 RGB40.6 51.1,105.27 RGB40.4 51.03,106 RGB40.2
  Bottom 0.152: v25.41,36.19 25.7,36.48 IC2.18
CS5  (via drill 0.38)
  Top 0.152: RGB5.2 57.45,27.02 56.9,26.47 25.37,26.47 24.71,27.14 24.71,35.91 24.47,36.14 v24.42,36.14
  Top 0.254: RGB5.6 57.45,29.07 RGB5.4 57.38,29.8 RGB5.2 RGB17.6 57.45,54.47 RGB17.4 57.38,55.2 RGB17.2 RGB29.6 57.45,79.87 RGB29.4 57.38,80.6 RGB29.2 RGB41.6 57.45,105.27 RGB41.4 57.38,106 RGB41.2
  Bottom 0.152: IC2.20 24.9,36.77 24.64,36.51 24.64,36.36 v24.42,36.14
CS6  (via drill 0.38)
  Top 0.152: RGB6.2 63.8,26.41 63.28,25.89 23.32,25.89 23.12,26.1 23.12,35.87 v23.55,36.3
  Top 0.254: RGB6.6 63.8,29.07 RGB6.4 63.73,29.8 RGB6.2 RGB18.6 63.8,54.47 RGB18.4 63.73,55.2 RGB18.2 63.8,57.89 63.25,58.44 60.6,58.44 60.27,58.76 60.27,73.14 60.67,73.54 63.2,73.54 63.8,74.14 RGB30.6 63.8,79.87 RGB30.4 63.73,80.6 RGB30.2 63.8,92.22 63.3,92.72 60.13,92.72 59.54,93.31 59.54,102.49 60.02,102.97 63.4,102.97 63.8,103.37 RGB42.6 63.8,105.27 RGB42.4 63.73,106 RGB42.2
  Bottom 0.152: IC2.21 23.53,38.59 23.38,38.44 23.38,37.75 23.77,37.36 23.77,36.52 v23.55,36.3
CS7  (via drill 0.38)
  Top 0.152: v22.95,36.71 22.5,36.26 22.5,25.66 22.79,25.38 69.88,25.38 70.15,25.65 RGB7.6
  Top 0.254: RGB43.2 70.15,105.42 RGB43.4 70.15,105.27 RGB43.6 RGB31.2 70.15,80.02 RGB31.4 70.08,79.3 RGB31.6 RGB19.2 70.08,55.2 RGB19.4 70.15,54.47 RGB19.6 RGB7.2 70.08,29.8 RGB7.4 70.15,29.07 RGB7.6
  Bottom 0.152: IC2.22 23.34,38.99 23.1,38.75 23.1,36.86 v22.95,36.71
CS8  (via drill 0.38)
  Top 0.152: v22.43,37.2 22.05,36.82 22.05,25.41 22.55,24.91 76.03,24.91 76.5,25.38 RGB8.6
  Top 0.254: RGB8.6 76.43,28.5 RGB8.4 76.43,29.8 RGB8.2 76.5,36.96 76.05,37.41 74.19,37.41 73.88,37.72 73.88,48.08 74.3,48.5 76.19,48.5 76.5,48.82 RGB20.6 76.5,54.47 RGB20.4 76.43,55.2 RGB20.2 76.43,55.35 RGB32.4 | RGB32.6 76.43,79.3 RGB32.4 | RGB32.4 76.43,80.6 RGB32.2 RGB44.6 76.43,104.7 RGB44.4 76.43,106 RGB44.2
  Bottom 0.152: v22.43,37.2 22.74,37.5 22.74,39.02 23.11,39.39 IC2.23
CS9  (via drill 0.38)
  Top 0.152: v22.24,37.91 22.24,37.71 21.77,37.24 21.77,25.3 22.43,24.64 82.37,24.64 82.85,25.11 RGB9.6
  Top 0.254: RGB9.6 82.78,28.5 RGB9.4 82.78,29.8 RGB9.2 82.85,36.68 83.3,37.14 85.61,37.14 85.98,37.51 85.98,47.6 85.21,48.37 83.27,48.37 82.83,48.81 82.83,53.8 RGB21.6 82.85,54.47 RGB21.4 82.78,55.2 RGB21.2 RGB33.6 82.85,79.87 RGB33.4 82.78,80.6 RGB33.2 RGB45.6 82.85,105.27 RGB45.4 82.78,106 RGB45.2
  Bottom 0.152: v22.24,37.91 22.46,38.12 22.46,39.14 23.11,39.79 IC2.24
CS10  (via drill 0.38)
  Top 0.152: v22.5,39.88 22.5,38.9 21.49,37.89 21.49,25.12 22.25,24.36 88.94,24.36 89.21,24.62 RGB10.6 89.13,28.49
  Top 0.254: RGB10.6 89.13,28.49 89.13,28.5 RGB10.4 89.13,29.8 RGB10.2 RGB22.6 89.2,54.47 RGB22.4 89.13,55.2 RGB22.2 RGB34.6 89.2,79.87 RGB34.4 89.13,80.6 RGB34.2 RGB46.6 89.2,105.27 RGB46.4 89.13,106 RGB46.2
  Bottom 0.152: IC2.25 23.05,40.19 22.62,39.76 v22.5,39.88 | v22.5,39.88
CS11  (via drill 0.38)
  Top 0.152: v22.25,41.18 21.91,40.83 21.91,38.7 21.21,38.01 21.21,25 22.14,24.08 22.53,24.08 22.62,23.98 95.17,23.98 95.56,24.37 RGB11.6 95.48,28.5
  Top 0.254: RGB47.2 95.55,105.42 RGB47.4 95.55,105.27 RGB47.6 RGB35.2 95.55,80.02 RGB35.4 95.55,79.87 RGB35.6 95.58,79.19 95.58,77.94 95.1,77.45 95.1,57 95.55,56.55 RGB23.2 95.48,55.2 RGB23.4 95.55,54.47 RGB23.6 RGB11.2 95.48,29.8 RGB11.4 95.48,28.5 RGB11.6
  Bottom 0.152: IC2.27 22.99,40.99 22.89,41.09 22.34,41.09 v22.25,41.18
CS12  (via drill 0.38)
  Top 0.152: v23.14,41.54 22.59,41.54 22.46,41.67 21.97,41.67 21.54,41.25 21.54,38.73 20.93,38.12 20.93,24.89 22.12,23.7 101.67,23.7 101.92,23.94 RGB12.6 | RGB12.4 101.83,29.8 RGB12.2
  Top 0.254: RGB12.6 RGB12.2 RGB24.6 101.9,54.47 RGB24.4 101.83,55.2 RGB24.2 101.9,56.35 102.27,56.72 105.42,56.72 105.79,57.09 105.79,75.68 105.26,76.21 102.34,76.21 101.9,76.65 RGB36.6 101.9,79.87 RGB36.4 101.83,80.6 RGB36.2 RGB48.6 101.9,105.27 RGB48.4 101.83,106 RGB48.2
  Bottom 0.152: IC2.28 23.27,41.39 23.13,41.53 v23.14,41.54
DATA
  Bottom 0.152: U1.4 44.12,70.78 44.35,71 44.79,71 45.01,71.23 45.01,73.84 44.76,74.1 44.16,74.1 44.01,74.26 44.01,76.57 44.29,76.86 MK1.1
DI_NEOPIXEL  (via drill 0.38)
  Top 0.152: v124.58,66.06 LED1.3
  Route2 0.152: v46.82,58.54 57.78,58.54 58.36,57.96 v58.35,57.96
  Bottom 0.152: U1.32 46.92,58.64 v46.82,58.54 | v58.35,57.96 123.74,57.96 124.13,58.35 124.13,65.6 v124.58,66.06
DO1
  Top 0.254: LED1.1 129.38,64.75 129.77,65.14 129.77,67.98 129.09,68.65 121.89,68.65 121.42,69.13 117.72,93.6 117.39,93.93 117.39,95.73 LED2.3
DO2
  Top 0.254: LED2.1 121.25,97.2 121.25,98.26 121.05,98.65 107.37,112.33 97.9,112.33 94.83,115.39 94.83,117.88 LED3.3
DO3
  Top 0.254: LED3.1 98.1,120.46 98.1,121.19 97.78,121.51 97,122.02 65.93,122.02 64.97,122.98 LED4.3
DO4
  Top 0.254: LED4.1 65.98,129.68 65.74,129.92 61.52,129.92 61.19,129.59 61.19,118.6 60.63,118.04 36.86,118.04 36.6,117.78 36.6,117.58 36.29,117.28 35.36,117.28 LED5.3
DO5
  Top 0.254: LED5.1 33.49,121.18 32.73,121.18 29.37,117.81 29.37,110.96 13.75,95.35 12.64,95.35 LED6.3
DO6
  Top 0.152: 3.83,70.36 3.83,78.51 9.35,84.03 9.35,94 8.94,94.41 8.94,96.61 9.96,97.63 10.58,97.63 LED6.1
  Top 0.254: LED7.3 4.93,65.06 5.21,65.34 5.21,68.97 3.83,70.36
DO7
  Top 0.254: LED7.1 1.6,65.75 0.93,65.08 0.93,63.97 1.6,63.3 2.91,63.3 3.58,62.63 3.58,56.08 4.54,55.12 9.47,50.19 9.47,40.8 10.02,40.25 13.55,40.25 13.92,39.87 13.92,35.8 LED8.3
DO8
  Top 0.254: LED8.1 9.71,33.23 9.71,32.67 12.44,29.94 12.44,28.83 22.28,19 30.55,19 35.19,14.36 35.19,12.47 LED9.3
DO9
  Top 0.254: LED9.1 33.58,9.57 33.95,9.2 64.67,9.2 65.15,8.72 65.15,4.85 LED10.3
DO10
  Top 0.254: LED10.1 66.25,1.05 71.72,1.05 72.05,1.38 72.05,11.59 72.59,12.12 93.31,12.12 94.55,13.37 95.33,13.37 LED11.3
DO11
  Top 0.152: LED11.1 97.31,10.41 97.84,9.88 98.41,9.88 102.84,14.31 102.84,20.38 117.46,35 118.3,35 LED12.3
GND  (via drill 0.38)
  Top 0.254: LED11.2 97.8,11.73 v99.3,13.23
  Bottom 0.152: MK1.3 48.9,76.03 48.91,76.02 | IC2.36 26.9,42.04 26.62,41.77 26.7,41.69 IC2.41 | IC2.29 25.51,41.79 v25.54,41.82 26.7,40.66 IC2.41 | IC2.4 27.89,40.99 | 27.89,40.99 27.88,41 | IC2.41 27.3,40.99 27.89,40.99 | IC2.41 27.95,41.64 v27.95,41.78
  other vias: 59.42,51.58 66.11,124.13 45.31,66.72 46.22,66.81 45.41,65.7 46.46,65.66 46.53,64.59 45.47,64.62 15.91,75.31 16.97,75.35 17.99,75.32 19.08,75.31 19,72.03 17.96,72.01 16.97,72 15.89,71.96 18.89,72.96 18.84,73.9 56.33,69.37 41.45,71.07 25.61,39.09 27.96,39.11 26.62,40.4 52.93,66.55 48.11,57.94
  pour Top: 154.22,-26.87 154.22,187.55 149.82,191.95 -21.55,191.95 -86.36,127.14 -86.36,-76.6 -56.7,-106.26 108.96,-106.26 158.57,-56.66 158.57,-31.23
  pour Bottom: 138.9,-65.2 138.9,156.32 114.89,180.33 -14.95,180.33 -46.59,148.7 -67.02,128.26 -67.02,-35.21 -2.38,-99.86 37.11,-99.86 107.59,-99.86 140.49,-66.95 138.98,-65.44 138.98,-65.24
  pour Route2: -40.17,17.68 -40.17,118.63 0.47,159.27 206.37,159.27 210.81,154.83 210.81,6.09 203.86,-0.86 -21.53,-0.86 -40.12,17.73
  pour Route15 (rank 6): -17.68,32.75 -17.68,127.99 7.35,153.02 104.38,153.02 108.64,148.76 133.11,124.29 133.11,35.88 94.44,-2.79 60.84,-2.79 17.53,-2.79 -17.74,32.47
  pour Route15: 44.38,64.37 44.38,67.18 45.17,67.98 51.79,67.98 52.08,67.69 53.1,68.71 53.1,70.04 58.3,70.04 59.78,68.55 59.78,61.04 45.76,61.04 44,62.8 44,63.97 44.31,64.28
INT1  (via drill 0.38)
  Route15 0.152: v20.28,47.89 20.28,51.18 20.85,51.75 21.24,51.75 21.54,52.06 21.54,56.83 21.88,57.17 35.76,57.17 35.91,57.01 50.08,57.01 50.25,57.18 v50.55,57.18
  Bottom 0.152: U2.4 20.32,47.93 v20.28,47.89 | v50.55,57.18 50.74,57.18 51.09,57.53 51.09,63.24 50.79,63.54 U1.27
INT2  (via drill 0.38)
  Route15 0.152: v21.03,52.24 21.03,57.08 21.4,57.45 35.87,57.45 36.03,57.29 49.97,57.29 50.31,57.64 v50.31,59.49
  Bottom 0.152: U2.9 20.82,52.05 v21.02,52.24 v21.03,52.24 | v50.31,59.49 50.31,62.86 50.04,63.14 U1.28
INTB  (via drill 0.38)
  Route2 0.152: v27.29,44.41 27.29,57.15 27.57,57.43 41.65,57.43 41.66,57.41 46.96,57.41 v47.33,57.79
  Bottom 0.152: IC2.37 27.3,44.1 | 27.3,44.1 26.93,44.47 26.57,44.47 26.49,44.55 26.49,45.28 R18.1 | 27.3,44.1 27.3,44.4 v27.29,44.41 | v47.33,57.79 47.32,57.8 U1.31
LED_R
  Bottom 0.152: U1.37 44.92,61.38 44.29,60.75 44.29,59.96 R10.1
N$1
  Bottom 0.152: D2.+ 44.3,58.78 R10.2
N$4
  Bottom 0.152: R14.1 Q1.3 56.97,62.86 C20.2
N$5
  Bottom 0.152: R8.2 5.04,64.31 5.71,64.98 J1.A5
N$6
  Bottom 0.152: U1.21 51.47,65.94 51.67,65.75 51.67,64.65 51.97,64.35 R14.2
N$8
  Bottom 0.152: J1.B5 5.33,67.98 5.12,68.19 5.12,71.24 5.42,71.53 6,71.53 6.26,71.79 R9.2
N$9  (via drill 0.38)
  Route2 0.152: v64.51,45.08 64.51,58.56 64.2,58.87 48.56,58.87 v48.22,59.21
  Bottom 0.152: S3.1 S3.2 64.6,44.99 v64.51,45.08 | v48.22,59.21 48.22,60.75 47.72,61.25 U1.30
N$10
  Bottom 0.152: IC2.30 22.64,42.19 22.49,42.34 R15.1
N$11
  Bottom 0.254: J2.2 16.28,48.99 16.73,49.44 16.73,51.47 Q2.3
N$12
  Bottom 0.254: R12.2 8.72,54.94 9.09,55.32 9.09,56.47 9.28,56.65 11.73,56.65 11.99,56.91 D1.-
N$13
  Bottom 0.254: U4.1 6.76,55.01 R12.1
N$14  (via drill 0.38)
  Route15 0.254: v8.75,66.86 8.75,65.45 v9.42,64.78
  Bottom 0.152: 9.42,63.63 9.34,63.54
  Bottom 0.254: C22.1 11.05,63.55 L2.1 9.34,63.54 8.38,63.54 8.09,63.83 J1.A4_B9 | J1.B4_A9 8.33,68.63 8.75,68.21 v8.75,66.86 | v9.42,64.78 9.42,63.63
N$15
  Bottom 0.152: R13.2 5.29,57.65 U4.5
N$16
  Bottom 0.254: R19.1 14.61,58.59 D4.+
N$17
  Bottom 0.254: R19.2 16.86,58.75 17.7,57.91 18.45,57.91 18.9,58.37 JP1.2
N$18
  Bottom 0.152: IC2.39 28.1,43.78 28.25,43.93 30.87,43.93 31.09,44.15 R16.2
QSPI_CS
  Bottom 0.152: U1.56 41.69,68.34 41.54,68.49 41.54,68.72 40.08,70.18 29.67,70.18 29.25,70.6 29.25,74.93 28.72,75.45 R4.1 25.65,75.43 R3.1 21.15,75.43 IC1.1
QSPI_SCLK
  Bottom 0.152: U1.52 41.38,66.74 40.42,67.7 40.42,68.26 39.62,69.07 22.28,69.07 21.13,67.92 10.92,67.92 10.6,68.25 10.6,72.34 11.17,72.91 IC1.6
QSPI_SD0
  Bottom 0.152: U1.53 41.52,67.14 40.7,67.96 40.7,68.38 39.74,69.35 22.16,69.35 21.2,68.39 11.75,68.39 11.45,68.69 11.45,71.41 11.69,71.64 IC1.5
QSPI_SD1
  Bottom 0.152: U1.55 41.7,67.94 41.26,68.38 41.26,68.61 39.97,69.91 23.85,69.91 23.64,70.12 23.64,73.82 23.28,74.17 IC1.2
QSPI_SD2
  Bottom 0.152: U1.54 41.51,67.54 40.98,68.07 40.98,68.49 39.85,69.63 23.74,69.63 23.36,70 23.36,72.53 22.98,72.91 IC1.3
QSPI_SD3
  Bottom 0.152: U1.51 41.29,66.34 40.15,67.48 40.15,67.95 39.75,68.35 39.75,68.54 39.5,68.79 22.51,68.79 21,67.28 10.23,67.28 10.02,67.5 10.02,73.71 10.48,74.17 IC1.7
SCL  (via drill 0.38)
  Route2 0.152: v43.63,70.76 43.7,70.83 43.72,70.83 43.72,59.03 43.46,58.78 24.08,58.78 23.79,58.49 v23.79,50.23 26.49,50.23 26.72,50 v26.72,43.97
  Bottom 0.152: U1.3 43.72,70.81 | 43.72,70.81 43.72,71.98 R5.1 | U2.13 23.58,50.02 v23.79,50.23 | v43.63,70.76 43.68,70.81 43.72,70.81 | IC2.35 26.5,43.75 26.5,43.76 v26.72,43.97
SDA  (via drill 0.38)
  Route2 0.152: v42.24,70.85 42.45,70.63 43,70.63 43.42,70.21 43.42,60.87 43.36,60.81 43.36,59.87 42.8,59.32 23.39,59.32 23.06,58.98 v23.06,49.53 25.72,49.53 26.01,49.24 v26.01,43.96
  Bottom 0.152: U1.2 43.32,70.36 43.06,70.63 42.43,70.63 42.22,70.85 v42.23,70.86 | U2.14 v23.05,49.52 v23.06,49.53 | R6.1 v42.23,70.86 | v42.24,70.85 v42.23,70.86 | IC2.34 26.1,43.63 25.93,43.8 25.93,43.88 v26.01,43.96
SDB
  Bottom 0.152: IC2.38 27.7,44.12 27.89,44.31 | 27.89,44.31 R17.2 29.33,45.31 C43.2 | 27.89,44.31 28,44.43 30.01,44.43 30.24,44.65 30.24,47.68 30.23,47.68 30.23,56.31 30.56,56.63 32.08,56.63 32.18,56.52 48.37,56.52 48.72,56.87 48.72,60.65 48.13,61.23 U1.29
SDO  (via drill 0.38)
  Route15 0.152: v25.29,59.81 25.29,59.84 25.68,60.23 36.37,60.23 36.6,60.46 36.6,66.82 36.61,66.83 36.61,69.32 36.97,69.67 50.03,69.67 v50.42,69.28
  Bottom 0.152: R7.2 53,69.27 52.7,68.97 52.7,67.37 52.46,67.13 50.1,67.13 | 50.1,67.13 48.97,67.13 U1.18 | U2.1 21.82,47.98 21.97,47.83 25.07,47.83 25.29,48.06 v25.29,59.81 | v50.42,69.28 50.42,67.46 50.1,67.13
SW01  (via drill 0.38)
  Top 0.254: RGB37.1 37.05,106.07 v37.08,106.1 | v104.62,106.13 103.31,106.13 RGB48.1 | v98.45,106.1 96.93,106.1 RGB47.1 | v92.17,106.1 92.14,106.07 RGB46.1 | v85.78,106.1 84.23,106.1 RGB45.1 | 77.87,106.06 RGB44.1 77.88,106.1 v79.74,106.1 | v73.07,106.1 73.04,106.07 RGB43.1 | v66.78,106.1 65.18,106.1 RGB42.1 | v60.35,106.1 58.83,106.1 RGB41.1 | v53.92,106.1 52.48,106.1 RGB40.1 | v47.65,106.1 46.13,106.1 RGB39.1 | v41.35,106.1 41.32,106.07 RGB38.1
  Route2 0.152: v36.81,40.16 36.81,34.62 37.34,34.09 86.52,34.09 87,34.57 87,102.43 86.47,102.96 81.86,102.96 81.65,103.17 81.65,105.7 81.24,106.11 v79.75,106.11 v79.74,106.1
  Bottom 0.152: IC2.1 36.53,42.19 36.81,41.92 v36.81,40.16
  Bottom 0.254: v104.62,106.13 104.59,106.1 v98.45,106.1 v92.17,106.1 v85.78,106.1 85.76,106.08 85.74,106.1 v79.74,106.1 v73.07,106.1 v66.78,106.1 v60.35,106.1 v53.92,106.1 v47.65,106.1 v41.35,106.1 v37.08,106.1
SW02  (via drill 0.38)
  Top 0.254: v104.45,105.34 RGB48.3 | v98.6,105.36 96.99,105.36 RGB47.3 | v92.11,105.36 90.64,105.36 RGB46.3 | v85.81,105.36 85.8,105.35 RGB45.3 | v79.6,105.36 77.94,105.36 RGB44.3 | v72.9,105.36 71.59,105.36 RGB43.3 | RGB42.3 66.71,105.35 v66.73,105.36 | RGB41.3 v60.39,105.35 v60.39,105.36 | v47.82,105.36 46.19,105.36 RGB39.3 | 52.54,105.36 RGB40.3 v54.57,105.35 v54.58,105.36 | RGB37.3 v35.46,105.35 v35.47,105.36 | v41.28,105.37 39.85,105.37 RGB38.3
  Route2 0.152: v36.2,40.65 36.2,33.93 36.53,33.61 86.87,33.61 87.28,34.02 87.28,103.04 86.75,103.58 84.53,103.58 84.22,103.89 84.22,105.15 84.43,105.36 v85.81,105.36
  Bottom 0.152: IC2.2 35.65,41.79 36.2,41.24 v36.2,40.65
  Bottom 0.254: v104.45,105.34 104.43,105.36 v98.6,105.36 v92.11,105.36 v85.81,105.36 v79.6,105.36 v72.9,105.36 v66.73,105.36 | v54.58,105.36 v47.82,105.36 v35.47,105.36 41.27,105.36 v41.28,105.37 | v54.58,105.36 v66.73,105.36 | v60.39,105.36 v60.4,105.36 v66.73,105.36 | v54.58,105.36
SW03  (via drill 0.38)
  Top 0.254: RGB37.5 36.55,104.62 v36.56,104.64 | v104.91,104.63 103.26,104.63 RGB48.5 | v98.68,104.64 RGB47.5 | v92.19,104.64 90.56,104.64 RGB46.5 | v85.78,104.64 85.77,104.62 RGB45.5 | v79.62,104.64 77.86,104.64 RGB44.5 | RGB43.5 72.88,104.62 v72.9,104.64 | v66.76,104.64 65.16,104.64 RGB42.5 | v60.38,104.64 58.81,104.64 RGB41.5 | 46.12,104.64 RGB39.5 47.9,104.62 v47.92,104.64 | RGB40.5 v54.13,104.64 | v41.47,104.66 39.78,104.66 RGB38.5
  Route2 0.152: v35.49,40.53 35.49,33.45 35.77,33.17 87.17,33.17 87.66,33.66 87.66,104.25 87.26,104.65 85.79,104.65 v85.78,104.64
  Bottom 0.152: IC2.3 35.27,41.39 35.5,41.16 35.5,40.54 v35.49,40.53
  Bottom 0.254: v104.91,104.63 v104.91,104.64 v98.68,104.64 v92.19,104.64 v85.78,104.64 v79.62,104.64 v72.9,104.64 v66.76,104.64 v60.38,104.64 v54.13,104.64 | v54.13,104.64 v36.56,104.64 41.45,104.64 v41.47,104.66 | v47.92,104.64 v54.12,104.64 v54.13,104.64
SW04  (via drill 0.38)
  Top 0.254: RGB25.1 v35.54,80.67 v35.54,80.68 | v105.19,80.68 RGB36.1 | v98.77,80.68 v98.77,80.67 RGB35.1 | v92.22,80.68 RGB34.1 | RGB33.1 v85.9,80.67 v85.9,80.68 | RGB32.1 79.71,80.67 v79.73,80.7 | v73.42,80.68 RGB31.1 | v66.66,80.68 RGB30.1 | v60.58,80.68 58.81,80.68 RGB29.1 | v54.12,80.68 RGB28.1 | v47.7,80.68 RGB27.1 | v41.42,80.68 RGB26.1
  Route2 0.152: v34.36,40.31 34.36,33.21 34.68,32.89 87.48,32.89 87.94,33.36 87.94,80.22 88.4,80.68 v92.22,80.68
  Bottom 0.152: IC2.5 32.5,40.59 32.54,40.63 34.05,40.63 v34.36,40.31
  Bottom 0.254: v105.19,80.68 v98.77,80.68 v92.22,80.68 v85.9,80.68 81.44,80.68 | v35.54,80.68 v41.42,80.68 v47.7,80.68 v54.12,80.68 v60.58,80.68 v66.66,80.68 v73.42,80.68 81.44,80.68 | v79.73,80.7 81.42,80.7 81.44,80.68
SW05  (via drill 0.38)
  Top 0.254: RGB25.3 v35.66,79.95 v35.67,79.95 | v105.35,79.95 RGB36.3 | v98.78,79.95 RGB35.3 | v92.22,79.95 RGB34.3 | v85.86,79.95 RGB33.3 | v79.85,79.95 v79.84,79.95 RGB32.3 | v73.34,79.95 RGB31.3 | v66.58,79.95 v66.57,79.95 RGB30.3 | v60.61,79.95 RGB29.3 | v54.08,79.95 RGB28.3 | v47.68,79.95 RGB27.3 | v41.4,79.95 RGB26.3
  Route2 0.152: v33.61,39.94 33.61,32.63 33.92,32.33 87.82,32.33 88.38,32.89 88.38,78.85 89.35,79.83 89.47,79.95 v92.22,79.95 | 85.86,79.93 v85.86,79.95
  Bottom 0.152: IC2.6 32.49,40.19 32.65,40.35 33.2,40.35 v33.61,39.94
  Bottom 0.254: v35.67,79.95 v41.4,79.95 v47.68,79.95 v54.08,79.95 v60.61,79.95 v66.58,79.95 v73.34,79.95 v79.85,79.95 v85.86,79.95 v92.22,79.95 v98.78,79.95 v105.35,79.95
SW06  (via drill 0.38)
  Top 0.254: RGB25.5 35.77,79.22 v35.78,79.22 | v105.61,79.22 RGB36.5 | v98.87,79.22 RGB35.5 | v92.19,79.22 RGB34.5 | v85.84,79.22 84.21,79.22 RGB33.5 | v79.85,79.22 77.86,79.22 RGB32.5 | v73.31,79.22 71.51,79.22 RGB31.5 | v66.68,79.22 v66.67,79.22 RGB30.5 | v60.55,79.22 58.81,79.22 RGB29.5 | v54.06,79.22 RGB28.5 | v47.77,79.22 46.11,79.22 RGB27.5 | v41.54,79.22 RGB26.5
  Route2 0.152: v32.86,39.86 33.25,39.46 33.25,32.39 33.6,32.05 88.37,32.05 88.66,32.33 88.66,78.74 89.14,79.22 92.18,79.22 v92.19,79.22
  Bottom 0.152: IC2.7 32.79,39.79 v32.86,39.86
  Bottom 0.254: v35.78,79.22 v41.54,79.22 v47.77,79.22 v54.06,79.22 v60.55,79.22 v66.68,79.22 v73.31,79.22 v79.85,79.22 v85.84,79.22 v92.19,79.22 v98.87,79.22 v105.61,79.22
SW07  (via drill 0.38)
  Top 0.254: RGB13.1 v35.79,55.27 v35.79,55.28 | v105.75,55.3 103.27,55.3 RGB24.1 | v98.81,55.28 RGB23.1 | v92.43,55.28 RGB22.1 | v42.57,55.28 RGB14.1 | v48.12,55.28 RGB15.1 | v55.08,55.28 RGB16.1 | v61.42,55.28 RGB17.1 | v67.21,55.28 v67.21,55.27 RGB18.1 | v74.45,55.28 RGB19.1 | v80.25,55.28 RGB20.1 | v86,55.28 RGB21.1
  Bottom 0.152: 33.11,39.34 30.09,39.34 30.03,39.39 IC2.8
  Bottom 0.254: v105.75,55.3 105.73,55.28 v98.81,55.28 v92.43,55.28 v86,55.28 v80.25,55.28 v74.45,55.28 v67.21,55.28 v61.42,55.28 v55.08,55.28 v48.12,55.28 v42.57,55.28 v35.79,55.28 35.66,55.28 34.84,54.46 34.84,53.31 35.38,52.78 37.2,52.78 37.63,52.35 37.63,39.76 37.21,39.34 33.11,39.34
SW08  (via drill 0.38)
  Top 0.254: RGB13.3 v35.88,54.55 | v105.82,54.55 RGB24.3 | v98.87,54.55 RGB23.3 | v92.49,54.55 RGB22.3 | v85.9,54.55 RGB21.3 | v80.28,54.55 RGB20.3 | v74.4,54.55 RGB19.3 | v67.16,54.55 v67.15,54.55 RGB18.3 | v61.44,54.55 RGB17.3 | v55.06,54.55 RGB16.3 | v48.02,54.55 RGB15.3 | v42.22,54.55 RGB14.3
  Bottom 0.152: 32.97,38.96 29.23,38.96 IC2.9
  Bottom 0.254: v105.82,54.55 v98.87,54.55 v92.49,54.55 v85.9,54.55 v80.28,54.55 v74.4,54.55 v67.16,54.55 v61.44,54.55 v55.06,54.55 v48.02,54.55 v42.22,54.55 v35.88,54.55 35.67,54.55 35.26,54.14 35.26,53.51 35.55,53.22 37.52,53.22 38.01,52.73 38.01,39.3 37.67,38.96 32.97,38.96
SW09  (via drill 0.38)
  Top 0.254: RGB13.5 v35.82,53.82 | v105.9,53.82 RGB24.5 | v98.81,53.82 RGB23.5 | v92.6,53.82 RGB22.5 | v85.96,53.82 RGB21.5 | v80.26,53.82 RGB20.5 | v74.42,53.82 RGB19.5 | v67.09,53.82 RGB18.5 | v61.42,53.82 RGB17.5 | v55.08,53.82 RGB16.5 | v48.11,53.82 RGB15.5 | v42.18,53.82 RGB14.5
  Bottom 0.152: 33,38.58 29.21,38.58 IC2.10
  Bottom 0.254: v35.82,53.82 39.29,53.82 | 39.29,53.82 v42.18,53.82 v48.11,53.82 v55.08,53.82 v61.42,53.82 v67.09,53.82 v74.42,53.82 v80.26,53.82 v85.96,53.82 v92.6,53.82 v98.81,53.82 v105.89,53.82 v105.9,53.82 | v35.82,53.82 | 39.29,53.82 39.29,53.76 38.39,52.86 38.39,39.14 37.83,38.58 33,38.58
SW10  (via drill 0.38)
  Top 0.254: RGB1.1 v35.56,29.87 v35.57,29.88 | v105.35,29.88 103.26,29.88 RGB12.1 | v98.74,29.88 v98.74,29.87 RGB11.1 | v92.21,29.88 RGB10.1 | v85.96,29.88 v85.96,29.87 RGB9.1 | v79.4,29.88 v79.4,29.87 RGB8.1 | v73.03,29.88 v73.03,29.87 RGB7.1 | v66.79,29.88 v66.79,29.87 RGB6.1 | v60.61,29.88 RGB5.1 | v54.38,29.88 RGB4.1 | v47.86,29.88 RGB3.1 | v41.84,29.88 RGB2.1
  Bottom 0.152: 28.1,36.24 IC2.12
  Bottom 0.254: v105.35,29.88 101.88,29.88 v98.74,29.88 v92.21,29.88 v85.96,29.88 v79.4,29.88 v73.03,29.88 v66.79,29.88 v60.61,29.88 v54.38,29.88 v47.86,29.88 v41.84,29.88 v35.57,29.88 29.11,29.88 28.96,30.03 28.96,35.77 28.7,36.03 28.31,36.03 28.1,36.24
SW11  (via drill 0.38)
  Top 0.254: RGB1.3 v35.68,29.15 v35.69,29.14 | v105.4,29.1 103.37,29.1 RGB12.3 | v98.72,29.14 RGB11.3 | v92.29,29.14 v92.28,29.15 RGB10.3 | v86.07,29.14 RGB9.3 | v79.44,29.14 RGB8.3 | v72.95,29.14 RGB7.3 | v66.88,29.14 RGB6.3 | v60.68,29.14 v60.67,29.15 RGB5.3 | v54.45,29.14 RGB4.3 | v47.61,29.14 RGB3.3 | v41.87,29.14 RGB2.3
  Bottom 0.152: 27.72,36.26 27.72,36.91 27.69,36.93 IC2.13
  Bottom 0.254: v105.4,29.1 105.36,29.14 v98.72,29.14 v92.29,29.14 v86.07,29.14 v79.44,29.14 v72.95,29.14 v66.88,29.14 v60.68,29.14 v54.45,29.14 v47.61,29.14 v41.87,29.14 v35.69,29.14 29.01,29.14 28.45,29.69 28.45,35.34 27.72,36.08 27.72,36.26
SW12  (via drill 0.38)
  Top 0.254: RGB1.5 v35.73,28.42 v35.73,28.43 | v105.59,28.39 103.28,28.39 RGB12.5 | v98.64,28.43 v98.63,28.42 RGB11.5 | v92.29,28.43 RGB10.5 | v85.95,28.43 84.21,28.43 RGB9.5 | v79.44,28.43 v79.43,28.42 RGB8.5 | v72.93,28.43 v72.92,28.42 RGB7.5 | v66.77,28.43 RGB6.5 | v60.64,28.43 v60.64,28.42 RGB5.5 | v54.45,28.43 RGB4.5 | v47.63,28.43 RGB3.5 | v41.73,28.43 RGB2.5
  Bottom 0.152: 27.3,35.9 IC2.14 | 28.02,33.89
  Bottom 0.254: v105.59,28.39 105.56,28.43 v98.64,28.43 v92.29,28.43 v85.95,28.43 v79.44,28.43 v72.93,28.43 v66.77,28.43 63.84,28.43 v60.64,28.43 57.48,28.43 v54.45,28.43 51.04,28.43 v47.63,28.43 v41.73,28.43 v35.73,28.43 28.79,28.43 28.02,29.2 28.02,33.89 28.02,35.18 27.3,35.9
USB_DM_IN
  Bottom 0.152: R1.1 39.91,63.63 40.62,64.34 U1.46
USB_DP_IN
  Bottom 0.152: U1.47 40.3,64.74 39.98,65.07 R2.1
USB_N
  Bottom 0.152: R1.2 37.43,63.82 35.75,63.82 32.75,60.82 21.42,60.82 19.81,62.43 19.81,64.88 19.09,65.59 8.11,65.59 8,65.48 J1.B7 6.14,65.48 5.99,65.64 5.99,66.33 6.14,66.48 J1.A7
USB_P
  Bottom 0.152: J1.A6 8,65.98 | 8,65.98 8.11,65.87 19.21,65.87 20.09,64.99 20.09,62.55 21.54,61.09 32.63,61.09 36.58,65.04 37.62,65.04 R2.2 | J1.B6 7.91,66.98 8.07,66.82 8.07,66.06 8,65.98
V_BATT  (via drill 0.38)
  Route15 0.254: v17.66,54.83 17.66,55.07 17.09,55.63 3.87,55.63 3.21,54.97 v3.21,53.54
  Bottom 0.254: C18.2 U4.3 3.21,54.98 v3.21,53.54 | SW1.1 10.51,38.41 11.83,39.73 11.83,47.18 12.84,48.19 17.18,48.19 17.71,48.71 17.71,53.54 Q2.2 17.66,53.59 v17.66,54.83
V_USB  (via drill 0.38)
  Route15 0.254: v15.96,50.35 15.96,53.49 16.38,53.91 18.06,53.91 18.75,54.59 18.75,56.23 18.23,56.74 8.1,56.74 7.81,57.04 7.81,59.18 v7.97,59.34
  Bottom 0.254: L2.2 9.34,62.33 C23.1 | C23.1 9.34,59.61 10.14,58.81 D3.+ 11.94,58.51 D1.+ | R11.2 15.78,53.6 Q2.1 15.77,50.55 v15.96,50.35 | C17.2 1.94,57.71 2.15,57.5 U4.4 3.24,58.58 3.61,58.96 7.58,58.96 v7.97,59.34 7.97,60.43 8.17,60.63 9.32,60.63 C23.1
VIN  (via drill 0.38)
  Route15 0.152: v22.69,40.59 20.68,40.59 20.41,40.86 20.41,44.72 v20.76,45.06
  Route15 0.254: v10.33,42.01 13.05,42.01 13.46,41.59 v13.46,41.47
  Bottom 0.152: v22.69,40.59 21.75,40.59 C26.2 21.68,39.56 C27.1 | IC2.19 25.28,37.87 25.27,37.87 25.27,36.76 24.92,36.4 24.92,35.99 24.92,35.98 24.92,35.81 24.65,35.54 23.8,35.54 23.51,35.25 C25.1 | 23.77,45.07 22.68,45.07 C28.2 v20.76,45.06 | 23.77,45.07 C29.1 | IC2.31 24.9,43.49 24.58,43.81 24.05,43.81 23.77,44.09 23.77,45.07
  Bottom 0.254: SW1.2 9.45,41.13 v10.33,42.01 10.33,44.28 6.25,48.36 6.25,51.35 7.36,52.46 9.8,52.46 10.14,52.8 D3.- | C16.2 18.06,41.4 U3.1 16.53,40.32 16.19,39.98 14.87,39.98 14.63,40.22 | 14.63,40.22 U3.3 14.58,41.46 13.47,41.46 v13.46,41.47 | IC2.26 v22.69,40.59 | C27.1 21.47,38.49 21.12,38.15 | 21.12,38.15 15.14,38.15 14.63,38.66 14.63,40.22 | C24.2 26.04,33.96 26.01,33.93 C42.+ C25.1 22.07,33.92 21.62,34.38 21.62,37.65 21.12,38.15
VOUT  (via drill 0.38)
  Route15 0.152: v39.92,67.01 39.94,66.99 39.94,66.95 39.82,66.83 v39.82,62.22 39.82,60.38 40.03,60.17 v53.97,60.17
  Bottom 0.152: U1.45 41.13,63.94 40.14,62.96 40.14,62.54 v39.82,62.22 38.78,62.22 C1.1 | U1.50 41.19,65.94 40.34,66.79 40.06,66.79 39.87,66.99 39.87,67.06 | C2.1 39.74,67.96 39.87,67.84 39.87,67.06 | v39.92,67.01 39.87,67.06 | U1.23 50.82,65.14 51.09,64.87 51.09,64.44 51.74,63.79 52.12,63.79 52.45,63.46 52.45,62.94 52.6,62.8 52.6,61.86 52.96,61.5 C3.1 54.25,60.4 54.02,60.17 v53.97,60.17
XIN
  Bottom 0.152: C21.2 Q1.1 58.57,65.83 58.3,65.57 52.17,65.57 51.97,65.77 51.97,66.11 51.75,66.33 48.97,66.33 U1.20